# EAGLE design Dashboard r4 (EAGLE 8.3.2)
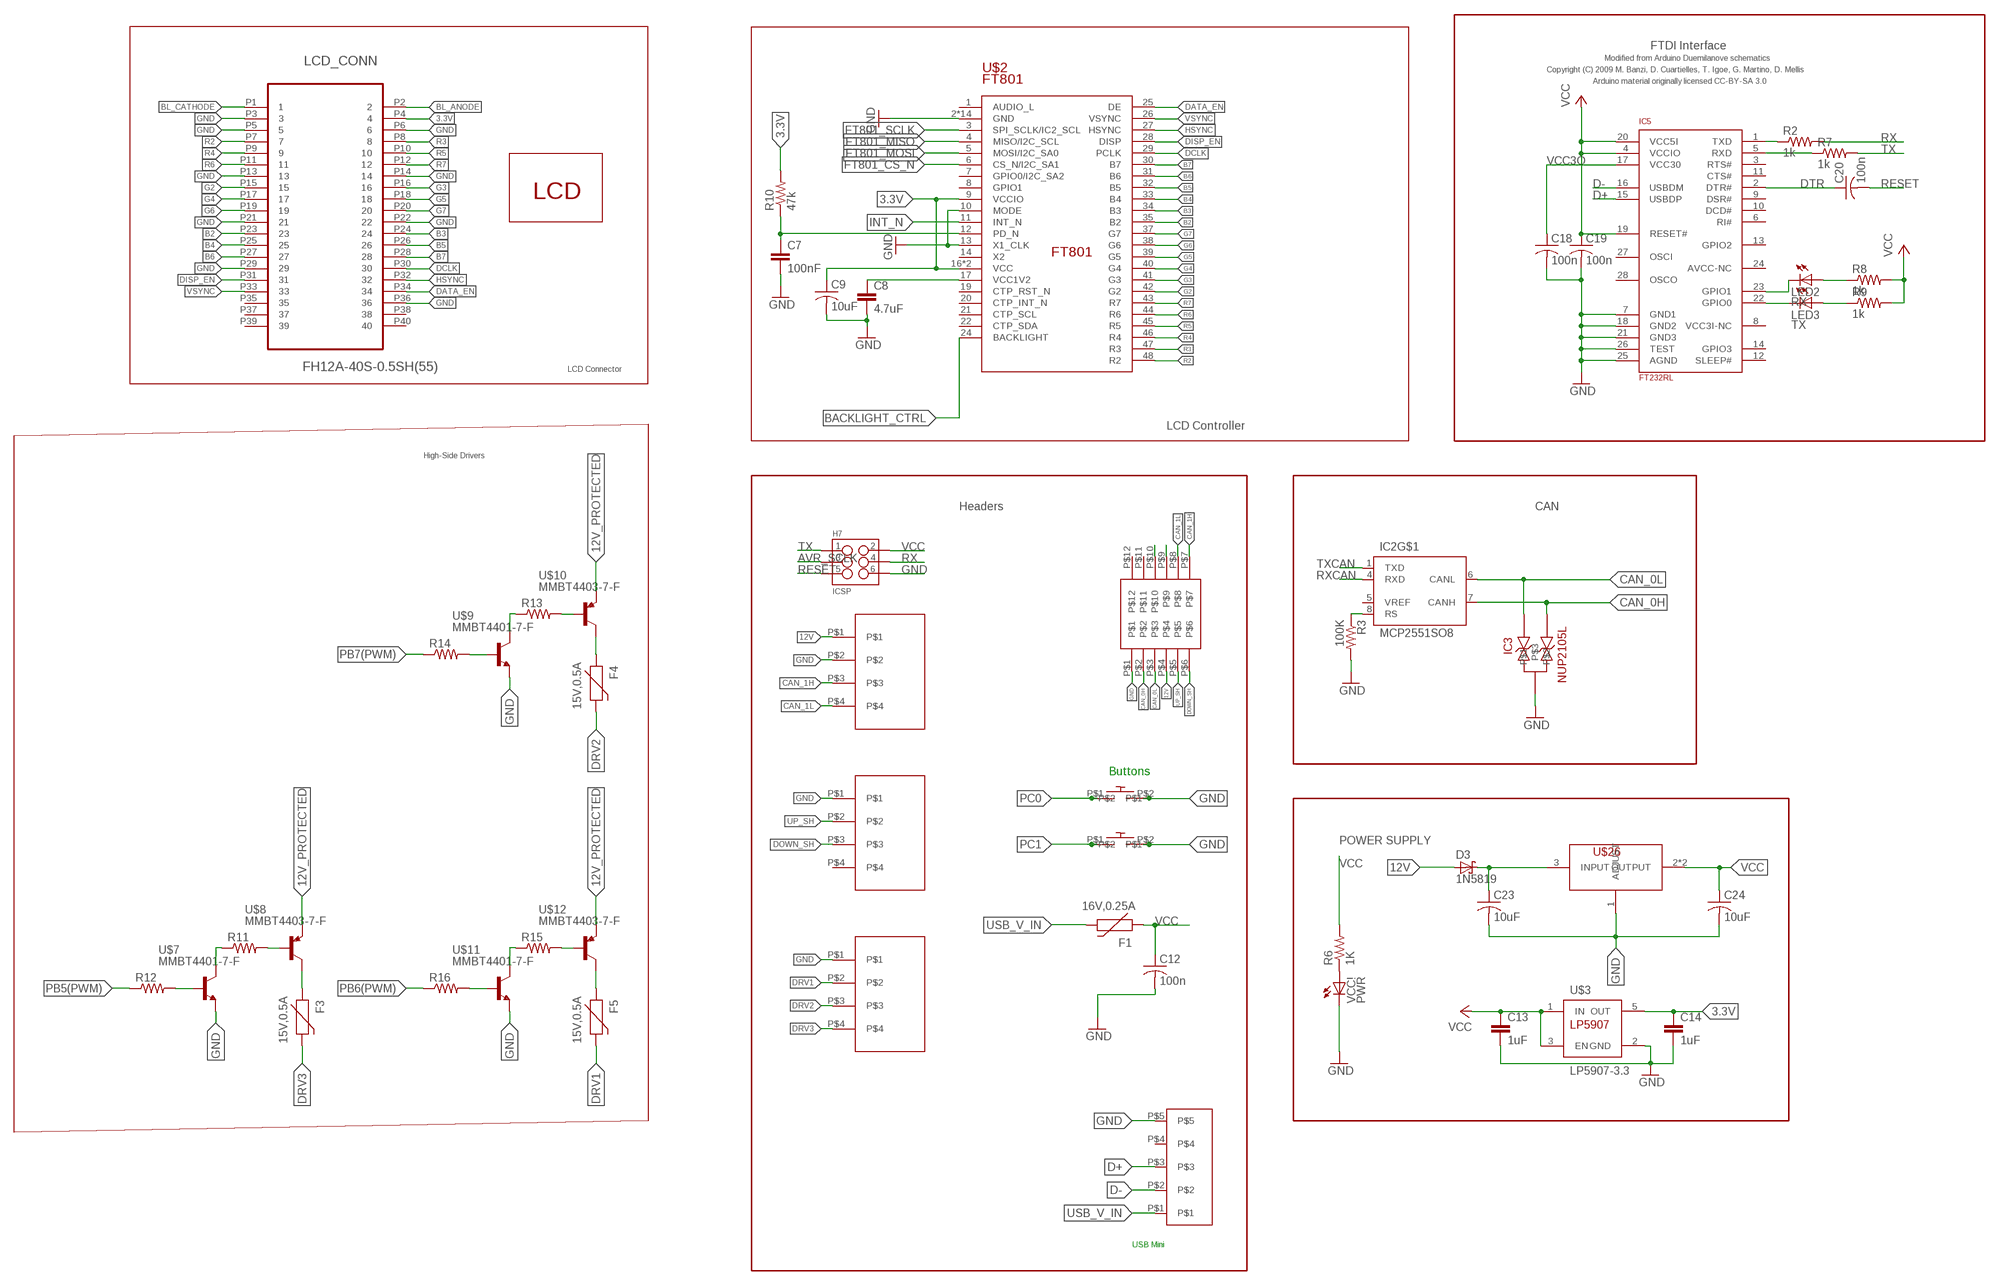
[diagram p0: schematic, sheet 1, part 1 of 2]
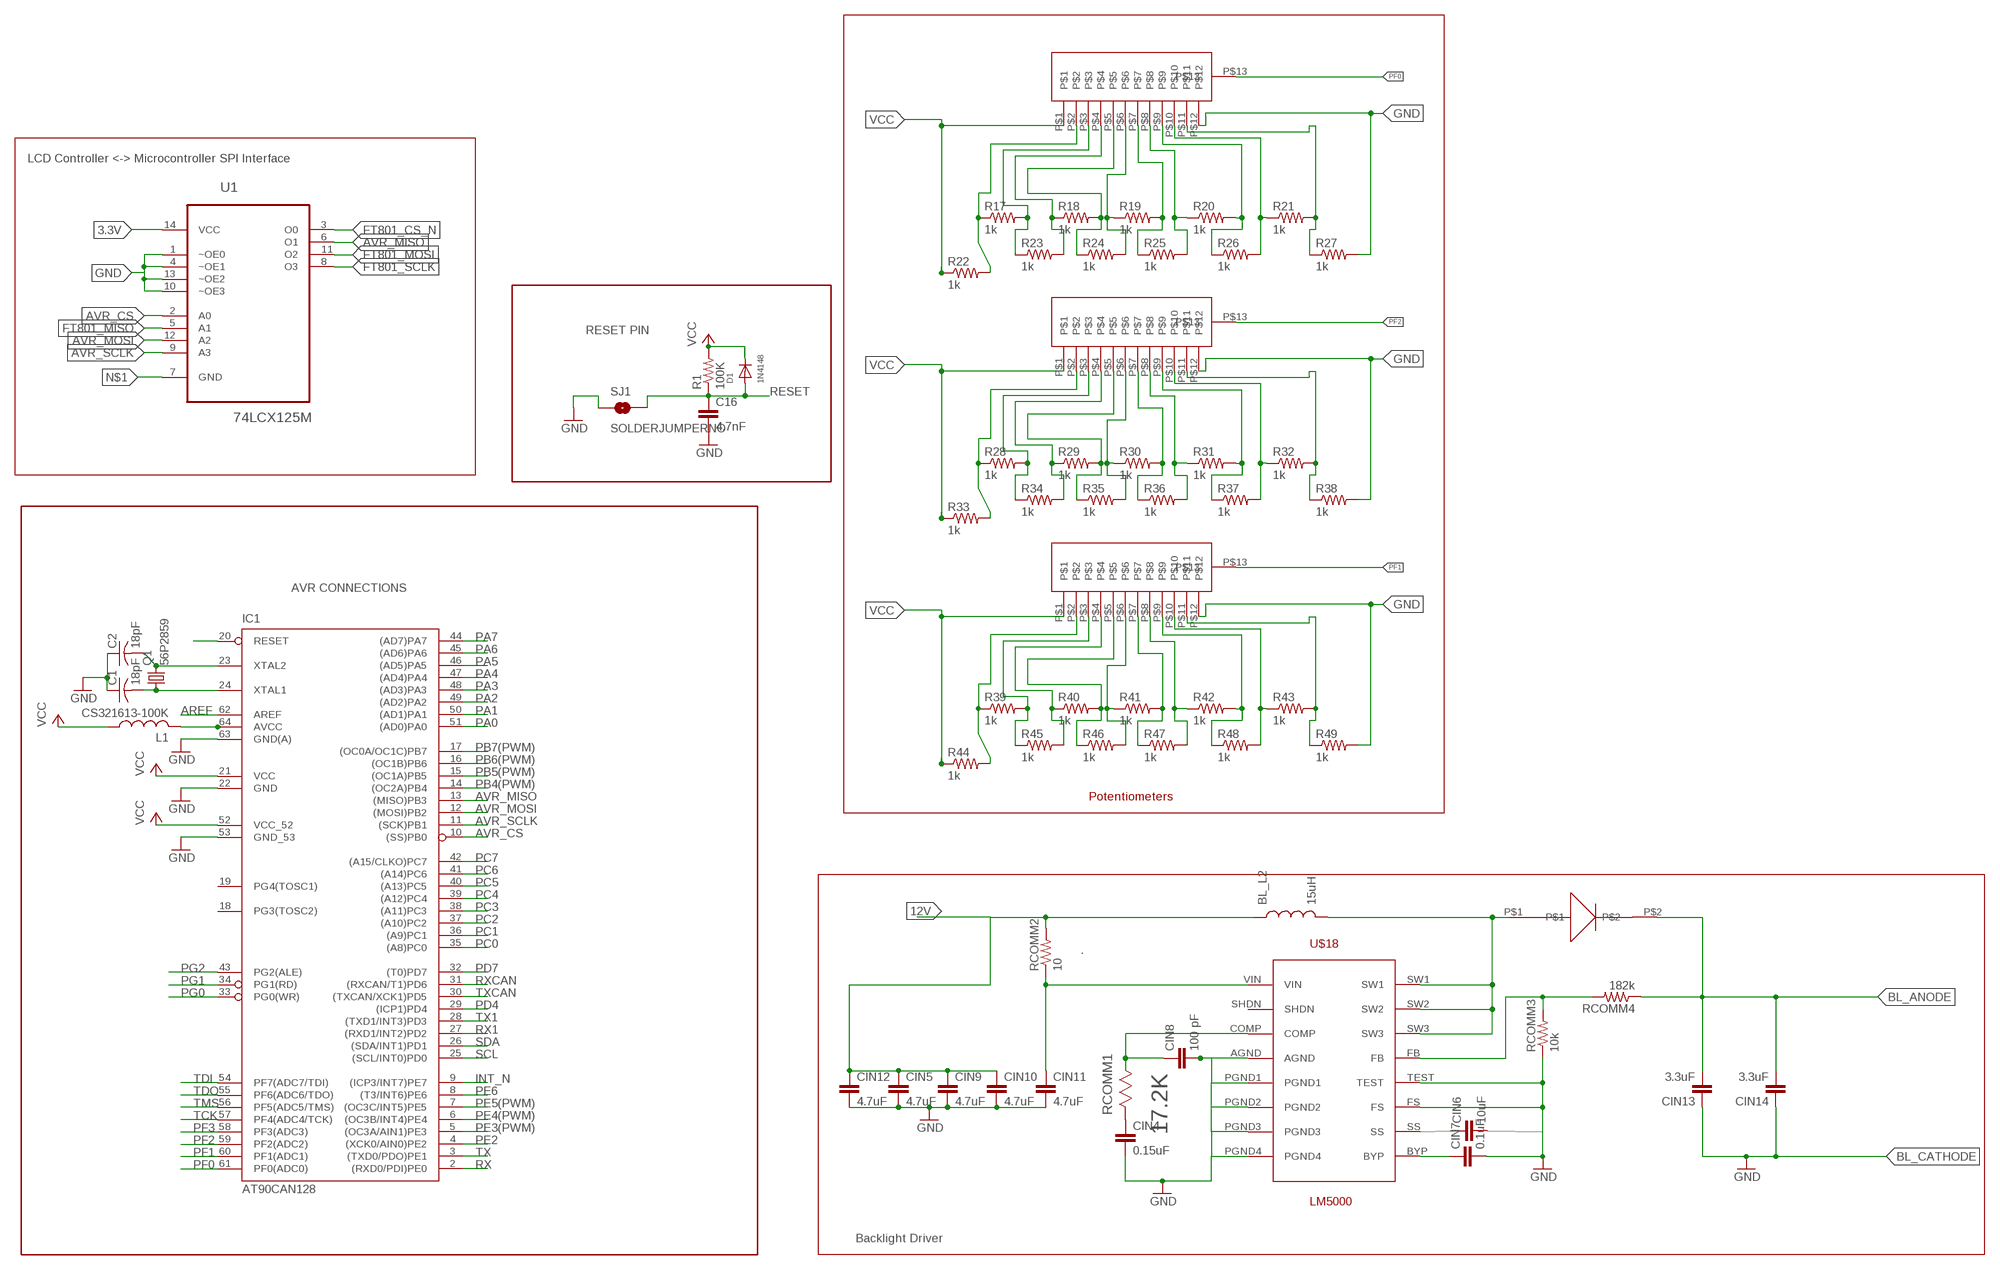
[diagram p1: schematic, sheet 1, part 2 of 2]

## Parts
BL_L2  15uH  LTF4022-D  [2-SMD]
C1  18pF  C-USC0805  [C0805]
C2  18pF  C-USC0805  [C0805]
C7  100nF  CAP0603-CAP  [0603-CAP]
C8  4.7uF  CAP0805  [0805]
C9  10uF  C-US025-024X044  [C025-024X044]
C12  100n  C-USC0805  [C0805]
C13  1uF  CAP0603-CAP  [0603-CAP]
C14  1uF  CAP0603-CAP  [0603-CAP]
C16  4.7nF  CAP0805  [0805]
C18  100n  C-USC0805  [C0805]
C19  100n  C-USC0805  [C0805]
C20  100n  C-USC0805  [C0805]
C23  10uF  C-USC0603  [C0603]
C24  10uF  C-USC0603  [C0603]
CIN4  0.15uF  CAP0805  [0805]
CIN5  4.7uF  CAP0805  [0805]
CIN6  10uF  CAP0805  [0805]
CIN7  0.1uF  CAP0805  [0805]
CIN8  100 pF  CAP0805  [0805]
CIN9  4.7uF  CAP0805  [0805]
CIN10  4.7uF  CAP0805  [0805]
CIN11  4.7uF  CAP0805  [0805]
CIN12  4.7uF  CAP0805  [0805]
CIN13  3.3uF  CAP0805  [0805]
CIN14  3.3uF  CAP0805  [0805]
D1  1N4148  DIODESOD-123  [SOD-123]
D3  1N5819  1N5819-BSOD123  [SOD123]
F1  16V,0.25A  PTCSMD  [PTC-1206]
F3  15V,0.5A  PTCSMD  [PTC-1206]
F4  15V,0.5A  PTCSMD  [PTC-1206]
F5  15V,0.5A  PTCSMD  [PTC-1206]
H7  ICSP  M03X2SMD_FCI  [2X3_SMD_FCI_54202-G30]
IC1  AT90CAN128  [TQFP64]
IC2  MCP2551SO8  [SO08]
IC3  NUP2105L  [SOT-23]
IC5  FT232RL  [SSOP28]
L1  CS321613-100K  L-USL3216C  [L3216C]
LCD_CONN  FH12A-40S-0.5SH(55)  [HIROSE_FH12A-40S-0.5SH(55)]
LED2  RX  LEDCHIPLED_0805  [CHIPLED_0805]
LED3  TX  LEDCHIPLED_0805  [CHIPLED_0805]
Q1  56P2859  CRYSTALSMD  [HC49UP]
R1  100K  R-US_R0805  [R0805]
R2  1k  R-US_R0805  [R0805]
R3  100K  R-US_R0805  [R0805]
R6  1K  R-US_R0805  [R0805]
R7  1k  R-US_R0805  [R0805]
R8  1k  R-US_R0805  [R0805]
R9  1k  R-US_R0805  [R0805]
R10  47k  RESISTOR0603  [0603-RES]
R11  RESISTOR0603  [0603-RES]
R12  RESISTOR0603  [0603-RES]
R13  RESISTOR0603  [0603-RES]
R14  RESISTOR0603  [0603-RES]
R15  RESISTOR0603  [0603-RES]
R16  RESISTOR0603  [0603-RES]
R17  1k  R-US_R0603  [R0603]
R18  1k  R-US_R0603  [R0603]
R19  1k  R-US_R0603  [R0603]
R20  1k  R-US_R0603  [R0603]
R21  1k  R-US_R0603  [R0603]
R22  1k  R-US_R0603  [R0603]
R23  1k  R-US_R0603  [R0603]
R24  1k  R-US_R0603  [R0603]
R25  1k  R-US_R0603  [R0603]
R26  1k  R-US_R0603  [R0603]
R27  1k  R-US_R0603  [R0603]
R28  1k  R-US_R0603  [R0603]
R29  1k  R-US_R0603  [R0603]
R30  1k  R-US_R0603  [R0603]
R31  1k  R-US_R0603  [R0603]
R32  1k  R-US_R0603  [R0603]
R33  1k  R-US_R0603  [R0603]
R34  1k  R-US_R0603  [R0603]
R35  1k  R-US_R0603  [R0603]
R36  1k  R-US_R0603  [R0603]
R37  1k  R-US_R0603  [R0603]
R38  1k  R-US_R0603  [R0603]
R39  1k  R-US_R0603  [R0603]
R40  1k  R-US_R0603  [R0603]
R41  1k  R-US_R0603  [R0603]
R42  1k  R-US_R0603  [R0603]
R43  1k  R-US_R0603  [R0603]
R44  1k  R-US_R0603  [R0603]
R45  1k  R-US_R0603  [R0603]
R46  1k  R-US_R0603  [R0603]
R47  1k  R-US_R0603  [R0603]
R48  1k  R-US_R0603  [R0603]
R49  1k  R-US_R0603  [R0603]
RCOMM1  17.2K  TNPW12062K00BEEN  [RESC3216X71N]
RCOMM2  10  RESISTOR0603  [0603-RES]
RCOMM3  10k  RESISTOR0603  [0603-RES]
RCOMM4  182k  RESISTOR0603  [0603-RES]
SJ1  SOLDERJUMPERNO  [SJ_2S-NO]
U1  74LCX125M  [SOIC127P600X175-14N]
U$2  FT801  [RGZ48_5P15X5P15]
U$3  LP5907-3.3  LP5907  [SOT23-DBV]
U$4  B160-FDICT_NB  [B160-FDICT-NB]
U$7  MMBT4401-7-F  [SOT-23-3]
U$8  MMBT4403-7-F  [SOT-23-3]
U$9  MMBT4401-7-F  [SOT-23-3]
U$10  MMBT4403-7-F  [SOT-23-3]
U$11  MMBT4401-7-F  [SOT-23-3]
U$12  MMBT4403-7-F  [SOT-23-3]
U$13  TCG043WQLBAANN-GN00  [TCG043WQLBAANN]
U$14  ROTSWITCH  [ROTSWITCH]
U$15  1734753-1  [1734753-1]
U$16  ROTSWITCH  [ROTSWITCH]
U$17  ROTSWITCH  [ROTSWITCH]
U$18  LM5000  [LM5000]
U$19  LP4OA1PBBTG  [LP4OA1PBBTG]
U$20  LP4OA1PBBTG  [LP4OA1PBBTG]
U$21  EN3C12M26X  [EN3C12M26X]
U$22  043650-0409  [043650-0409]
U$23  043650-0409  [043650-0409]
U$24  043650-0409  [043650-0409]
U$26  NCP1117  [SOT-223-4]
VCC!  PWR  LEDCHIPLED_0805  [CHIPLED_0805]

## Nets
3.3V: C9.1 C14.1 LCD_CONN.P4 R10.2 U1.14(VCC) U$2.9(VCCIO) U$2.16(VCC) U$2.18(VCC) U$3.5(OUT)
5V_REG_IN: C23.1 D3.C U$26.3(INPUT)
12V [Class2]: BL_L2.1 CIN5.1 CIN9.1 CIN10.1 CIN12.1 D3.A RCOMM2.2 U$21.P$4 U$22.P$1
12V_PROTECTED [Class3]: U$8.P$3(E) U$10.P$3(E) U$12.P$3(E)
AREF: IC1.62(AREF)
AVR_CS: IC1.10((SS)PB0) U1.2(A0)
AVR_MISO: IC1.13((MISO)PB3) U1.6(O1)
AVR_MOSI: IC1.12((MOSI)PB2) U1.12(A2)
AVR_SCLK: H7.3 IC1.11((SCK)PB1) U1.9(A3)
B2: LCD_CONN.P23 U$2.35(B2)
B3: LCD_CONN.P24 U$2.34(B3)
B4: LCD_CONN.P25 U$2.33(B4)
B5: LCD_CONN.P26 U$2.32(B5)
B6: LCD_CONN.P27 U$2.31(B6)
B7: LCD_CONN.P28 U$2.30(B7)
BACKLIGHT_CTRL: U$2.24(BACKLIGHT)
BL_ANODE [Class1]: CIN13.2 CIN14.2 LCD_CONN.P2 RCOMM4.1 U$4.P$2
BL_CATHODE: CIN13.1 CIN14.1 LCD_CONN.P1 ; supply symbol labelled GND
CAN_0H [Class1]: IC2.7(CANH) IC3.2 U$21.P$2
CAN_0L [Class1]: IC2.6(CANL) IC3.1 U$21.P$3
CAN_1H: U$21.P$7 U$22.P$3
CAN_1L: U$21.P$8 U$22.P$4
D+: IC5.15(USBDP) U$15.P$3
D-: IC5.16(USBDM) U$15.P$2
DATA_EN: LCD_CONN.P34 U$2.25(DE)
DCLK: LCD_CONN.P30 U$2.29(PCLK)
DISP_EN: LCD_CONN.P31 U$2.28(DISP)
DOWN_SH: U$21.P$6 U$23.P$3
DRV1 [Class3]: F5.2 U$24.P$2
DRV2 [Class3]: F4.2 U$24.P$3
DRV3 [Class3]: F3.2 U$24.P$4
DTR: C20.1 IC5.2(DTR#)
FT801_CS_N: U1.3(O0) U$2.6(CS_N/I2C_SA1)
FT801_MISO: U1.5(A1) U$2.4(MISO/I2C_SCL)
FT801_MOSI: U1.11(O2) U$2.5(MOSI/I2C_SA0)
FT801_SCLK: U1.8(O3) U$2.3(SPI_SCLK/IC2_SCL)
G2: LCD_CONN.P15 U$2.42(G2)
G3: LCD_CONN.P16 U$2.41(G3)
G4: LCD_CONN.P17 U$2.40(G4)
G5: LCD_CONN.P18 U$2.39(G5)
G6: LCD_CONN.P19 U$2.38(G6)
G7: LCD_CONN.P20 U$2.37(G7)
GND [GND]: C1.1 C2.1 C7.2 C8.2 C9.2 C12.2 C13.2 C14.2 C16.2 C18.2 C19.2 C23.2 C24.2 CIN4.2 CIN5.2 CIN6.2 CIN7.2 CIN8.2 CIN9.2 CIN10.2 CIN11.2 CIN12.2 H7.6 IC1.22(GND) IC1.53(GND_53) IC1.63(GND(A)) IC3.3 IC5.7(GND1) IC5.18(GND2) IC5.21(GND3) IC5.25(AGND) IC5.26(TEST) LCD_CONN.P3 LCD_CONN.P5 LCD_CONN.P6 LCD_CONN.P13 LCD_CONN.P14 LCD_CONN.P21 LCD_CONN.P22 LCD_CONN.P29 LCD_CONN.P36 R3.2 R27.2 R38.2 R49.2 RCOMM3.1 SJ1.1 U1.1(~OE0) U1.4(~OE1) U1.10(~OE3) U1.13(~OE2) U$2.2(GND) U$2.10(MODE) U$2.13(X1_CLK) U$2.15(GND) U$2.23(GND) U$2.36(GND) U$2.EP(GND) U$2.V_1(GND) U$2.V_2(GND) U$2.V_3(GND) U$2.V_4(GND) U$2.V_5(GND) U$2.V_6(GND) U$2.V_7(GND) U$2.V_8(GND) U$2.V_9(GND) U$3.2(GND) U$7.P$3(E) U$9.P$3(E) U$11.P$3(E) U$14.P$12 U$15.P$5 U$16.P$12 U$17.P$12 U$18.AGND U$18.FS U$18.PGND1 U$18.PGND2 U$18.PGND3 U$18.PGND4 U$18.TEST U$19.P$2 U$20.P$2 U$21.P$1 U$22.P$2 U$23.P$1 U$24.P$1 U$26.1(ADJUST) VCC!.C
HSYNC: LCD_CONN.P32 U$2.27(HSYNC)
INT_N: IC1.9((ICP3/INT7)PE7) U$2.11(INT_N)
M8RXD: IC5.1(TXD) R2.1
M8TXD: IC5.5(RXD) R7.1
N$1 [Class2]: U1.7(GND)
N$2: C8.1 U$2.17(VCC1V2)
N$3: C7.1 R10.1 U$2.12(PD_N)
N$4: CIN4.1 RCOMM1.2
N$6: IC2.8(RS) R3.1
N$9: R6.1 VCC!.A
N$11: C1.2 IC1.24(XTAL1) Q1.1
N$22: IC1.64(AVCC) L1.2
N$27 [Class3]: R12.2 U$7.P$2(B)
N$28 [Class3]: R11.2 U$8.P$2(B)
N$29 [Class3]: R11.1 U$7.P$1(C)
N$30 [Class3]: F3.1 U$8.P$1(C)
N$31 [Class3]: R14.2 U$9.P$2(B)
N$32: IC5.23(GPIO1) LED2.C
N$33 [Class3]: R13.2 U$10.P$2(B)
N$34: IC5.22(GPIO0) LED3.C
N$35: LED2.A R8.1
N$36: LED3.A R9.1
N$37 [Class3]: R13.1 U$9.P$1(C)
N$38 [Class3]: F4.1 U$10.P$1(C)
N$39 [Class3]: R16.2 U$11.P$2(B)
N$40 [Class3]: R15.2 U$12.P$2(B)
N$41 [Class3]: R15.1 U$11.P$1(C)
N$42 [Class3]: F5.1 U$12.P$1(C)
N$43: R17.1 R22.2 U$14.P$2
N$44: R17.2 R23.1 U$14.P$3
N$45: R18.1 R23.2 U$14.P$4
N$46: R18.2 R24.1 U$14.P$5
N$47: R20.1 R25.2 U$14.P$8
N$48: R20.2 R26.1 U$14.P$9
N$49: R19.1 R24.2 U$14.P$6
N$50: R19.2 R25.1 U$14.P$7
N$51: R21.1 R26.2 U$14.P$10
N$52: R28.1 R33.2 U$16.P$2
N$53: R21.2 R27.1 U$14.P$11
N$54: R28.2 R34.1 U$16.P$3
N$55: R29.1 R34.2 U$16.P$4
N$56: R29.2 R35.1 U$16.P$5
N$57: R31.1 R36.2 U$16.P$8
N$58: R31.2 R37.1 U$16.P$9
N$59: R30.1 R35.2 U$16.P$6
N$60: R30.2 R36.1 U$16.P$7
N$61: R32.1 R37.2 U$16.P$10
N$62: R32.2 R38.1 U$16.P$11
N$63: R39.1 R44.2 U$17.P$2
N$64: R39.2 R45.1 U$17.P$3
N$65: R40.1 R45.2 U$17.P$4
N$66: R40.2 R46.1 U$17.P$5
N$67: R42.1 R47.2 U$17.P$8
N$68: R42.2 R48.1 U$17.P$9
N$69: R41.1 R46.2 U$17.P$6
N$70: R41.2 R47.1 U$17.P$7
N$71: R43.1 R48.2 U$17.P$10
N$72: R43.2 R49.1 U$17.P$11
N$75: CIN8.1 RCOMM1.1 U$18.COMP
N$77: CIN11.1 RCOMM2.1 U$18.VIN
N$79: BL_L2.2 U$4.P$1 U$18.SW1 U$18.SW2 U$18.SW3
N$80: U$21.P$10
N$81: U$21.P$9
N$82: RCOMM3.2 RCOMM4.2 U$18.FB
N$85: CIN6.1 U$18.SS
N$87: CIN7.1 U$18.BYP
PA0: IC1.51((AD0)PA0)
PA1: IC1.50((AD1)PA1)
PA2: IC1.49((AD2)PA2)
PA3: IC1.48((AD3)PA3)
PA4: IC1.47((AD4)PA4)
PA5: IC1.46((AD5)PA5)
PA6: IC1.45((AD6)PA6)
PA7: IC1.44((AD7)PA7)
PB4(PWM): IC1.14((OC2A)PB4)
PB5(PWM): IC1.15((OC1A)PB5) R12.1
PB6(PWM): IC1.16((OC1B)PB6) R16.1
PB7(PWM): IC1.17((OC0A/OC1C)PB7) R14.1
PC0: IC1.35((A8)PC0) U$19.P$1
PC1: IC1.36((A9)PC1) U$20.P$1
PC2: IC1.37((A10)PC2)
PC3: IC1.38((A11)PC3)
PC4: IC1.39((A12)PC4)
PC5: IC1.40((A13)PC5)
PC6: IC1.41((A14)PC6)
PC7: IC1.42((A15/CLKO)PC7)
PD4: IC1.29((ICP1)PD4)
PD7: IC1.32((T0)PD7)
PE2: IC1.4((XCK0/AIN0)PE2)
PE3(PWM): IC1.5((OC3A/AIN1)PE3)
PE4(PWM): IC1.6((OC3B/INT4)PE4)
PE5(PWM): IC1.7((OC3C/INT5)PE5)
PE6: IC1.8((T3/INT6)PE6)
PF0: IC1.61(PF0(ADC0)) U$14.P$13
PF1: IC1.60(PF1(ADC1)) U$17.P$13
PF2: IC1.59(PF2(ADC2)) U$16.P$13
PF3: IC1.58(PF3(ADC3))
PG0: IC1.33(PG0(WR))
PG1: IC1.34(PG1(RD))
PG2: IC1.43(PG2(ALE))
R2: LCD_CONN.P7 U$2.48(R2)
R3: LCD_CONN.P8 U$2.47(R3)
R4: LCD_CONN.P9 U$2.46(R4)
R5: LCD_CONN.P10 U$2.45(R5)
R6: LCD_CONN.P11 U$2.44(R6)
R7: LCD_CONN.P12 U$2.43(R7)
RESET [Class1]: C16.1 C20.2 D1.A H7.5 IC1.20(RESET) R1.1 SJ1.2
RX: H7.4 IC1.2((RXD0/PDI)PE0) R2.2
RX1: IC1.27((RXD1/INT2)PD2)
RXCAN: IC1.31((RXCAN/T1)PD6) IC2.4(RXD)
SCL: IC1.25((SCL/INT0)PD0)
SDA: IC1.26((SDA/INT1)PD1)
TCK: IC1.57(PF4(ADC4/TCK))
TDI: IC1.54(PF7(ADC7/TDI))
TDO: IC1.55(PF6(ADC6/TDO))
TMS: IC1.56(PF5(ADC5/TMS))
TX: H7.1 IC1.3((TXD0/PDO)PE1) R7.2
TX1: IC1.28((TXD1/INT3)PD3)
TXCAN: IC1.30((TXCAN/XCK1)PD5) IC2.1(TXD)
UP_SH [GND]: U$21.P$5 U$23.P$2
USB_V_IN [Class3]: F1.2 U$15.P$1
VCC [Class1]: C12.1 C13.1 C19.1 C24.1 D1.C F1.1 H7.2 IC1.21(VCC) IC1.52(VCC_52) IC5.4(VCCIO) IC5.19(RESET#) IC5.20(VCC5I) L1.1 R1.2 R6.2 R8.2 R9.2 R22.1 R33.1 R44.1 U$3.1(IN) U$3.3(EN) U$14.P$1 U$16.P$1 U$17.P$1 U$26.2(OUTPUT) U$26.4(OUTPUT)
VCC3O: C18.1 IC5.17(VCC30)
VSYNC: LCD_CONN.P33 U$2.26(VSYNC)
XTAL1: C2.2 IC1.23(XTAL2) Q1.2
Unconnected: IC1.18(PG3(TOSC2)) IC1.19(PG4(TOSC1)) IC2.5(VREF) IC5.3(RTS#) IC5.6(RI#) IC5.8(VCC3I-NC) IC5.9(DSR#) IC5.10(DCD#) IC5.11(CTS#) IC5.12(SLEEP#) IC5.13(GPIO2) IC5.14(GPIO3) IC5.24(AVCC-NC) IC5.27(OSCI) IC5.28(OSCO) LCD_CONN.P35 LCD_CONN.P37 LCD_CONN.P38 LCD_CONN.P39 LCD_CONN.P40 U$2.1(AUDIO_L) U$2.7(GPIO0/I2C_SA2) U$2.8(GPIO1) U$2.14(X2) U$2.19(CTP_RST_N) U$2.20(CTP_INT_N) U$2.21(CTP_SCL) U$2.22(CTP_SDA) U$15.P$4 U$18.SHDN U$21.P$11 U$21.P$12 U$23.P$4

## Notes on the sheet
- LCD Controller <-> Microcontroller SPI Interface
- FTDI Interface
- Modified from Arduino Duemilanove schematics
- Copyright (C) 2009 M. Banzi, D. Cuartielles, T. Igoe, G. Martino, D. Mellis
- Arduino material originally licensed CC-BY-SA 3.0
- RESET PIN
- AVR CONNECTIONS
- LCD Connector
- LCD Controller
- High-Side Drivers
- Headers | CAN
- Potentiometers
- Buttons
- POWER SUPPLY
- Backlight Driver
- USB Mini

## Power pins joined to a net without a drawn wire
GND: IC2.2(GND)
VCC: IC2.3(VCC)

## Library data of the parts
BL_L2 = tdk:LTF4022-D: LTF4022
C1 C2 C12 C18-C20 C23 C24 = rcl:C-US: CAPACITOR, American symbol
C7 C8 C13 C14 C16 CIN4-CIN14 = SparkFun-Capacitors:CAP: Capacitor Standard 0603 ceramic capacitor, and 0.1" leaded capacitor.
C9 = resistor:C-US: CAPACITOR, American symbol
D1 = adafruit:DIODE: Diode SMADIODE - SMA Surface Mount Package 20V 1A Schottky Diode Digikey: 641-1014-6-ND DO-1N4148 - Through Hole Small Current Diode SOD-123 20V 1 A (.5mV Vf) Schottky Diode - Digikey: MBRX120TPMSCT-ND SOD-323 10V 570mA (.38mV Vf, 3ns) Schottky Diode - Digikey: ZLLS410CT-ND SOD-523 30V 30mA Schottky Diode (RB751S-40TE61) - Digikey: RB751S-40TE61CT-ND SOT23-R/W - SOT23 Package (R = Solder Paste/Reflow Ovens, W = Hand-Soldering) BAT54Film 40V 300mA - Digikey: 497-7162-1-ND
D3 = diode:1N581*: 1.0A SCHOTTKY BARRIER RECTIFIER Source: http://www.diodes.com/datasheets/ds23001.pdf
F1 F3-F5 = SparkFun:PTC: Resettable Fuse PTC Resettable Fuse. Spark Fun Electronics SKU : COM-08357
H7 = SparkFun-Connectors:M03X2: 2x3 .1" header. Shrouded, with keying- CONN-10681 SMT- CONN-11415 Pogo pins- HW-11044
IC1 = at90can128:AT90CAN128
IC2 = can:MCP2551: CAN Tranceiver Microchip
IC3 = Artificial Science:NUP2105L
IC5 = SmartPrj:FT232RL
L1 = rcl:L-US: INDUCTOR, American symbol
LCD_CONN = hirose:FH12A-40S-0.5SH(55): SOCKET FFC/FPC, ZIF, 0.5MM, 40WAY; MPN: FH12A-40S-0.5SH(55); OC_FARNELL: 1324569; OC_NEWARK: 34M6194; PACKAGE: SOCKET FFC/FPC, ZIF, 0.5MM, 40WAY; SUPPLIER: Hirose
LED2 LED3 VCC! = led:LED: LED OSRAM: - CHIPLED LG R971, LG N971, LY N971, LG Q971, LY Q971, LO R971, LY R971 LH N974, LH R974 LS Q976, LO Q976, LY Q976 LO Q996 - Hyper CHIPLED LW Q18S LB Q993, LB Q99A, LB R99A - SideLED LS A670, LO A670, LY A670, LG A670, LP A670 LB A673, LV A673, LT A673, LW A673 LH A674 LY A675 LS A676, LA A676, LO A676, LY A676, LW A676 LS A679, LY A679, LG A679 - Hyper Micro SIDELED® LS Y876, LA Y876, LO Y876, LY Y876 LT Y87S - SmartLED LW L88C, LW L88S LB L89C, LB L89S, LG L890 LS L89K, LO L89K, LY L89K LS L896, LA L896, LO L896, LY L896 - TOPLED LS T670, LO T670, LY T670, LG T670, LP T670 LSG T670, LSP T670, LSY T670, LOP T670, LYG T670 LG T671, LOG T671, LSG T671 LB T673, LV T673, LT T673, LW T673 LH T674 LS T676, LA T676, LO T676, LY T676, LB T676, LH T676, LSB T676, LW T676 LB T67C, LV T67C, LT T67C, LS T67K, LO T67K, LY T67K, LW E67C LS E67B, LA E67B, LO E67B, LY E67B, LB E67C, LV E67C, LT E67C LW T67C LS T679, LY T679, LG T679 LS T770, LO T770, LY T770, LG T770, LP T770 LB T773, LV T773, LT T773, LW T773 LH T774 LS E675, LA E675, LY E675, LS T675 LS T776, LA T776, LO T776, LY T776, LB T776 LHGB T686 LT T68C, LB T68C - Hyper Mini TOPLED® LB M676 - Mini TOPLED Santana® LG M470 LS M47K, LO M47K, LY M47K Source: http://www.osram.convergy.de LUXEON: - LUMILED® LXK2-PW12-R00, LXK2-PW12-S00, LXK2-PW14-U00, LXK2-PW14-V00 LXK2-PM12-R00, LXK2-PM12-S00, LXK2-PM14-U00 LXK2-PE12-Q00, LXK2-PE12-R00, LXK2-PE12-S00, LXK2-PE14-T00, LXK2-PE14-U00 LXK2-PB12-K00, LXK2-PB12-L00, LXK2-PB12-M00, LXK2-PB14-N00, LXK2-PB14-P00, LXK2-PB14-Q00 LXK2-PR12-L00, LXK2-PR12-M00, LXK2-PR14-Q00, LXK2-PR14-R00 LXK2-PD12-Q00, LXK2-PD12-R00, LXK2-PD12-S00 LXK2-PH12-R00, LXK2-PH12-S00 LXK2-PL12-P00, LXK2-PL12-Q00, LXK2-PL12-R00 Source: www.luxeon.com KINGBRIGHT: KA-3528ASYC Source: www.kingbright.com
Q1 = SparkFun-FreqCtrl:CRYSTAL: Various standard crystals. Proven footprints. Spark Fun Electronics SKU : COM-00534
R1-R3 R6-R9 R17-R49 = rcl:R-US_: RESISTOR, American symbol
R10-R16 RCOMM2-RCOMM4 = SparkFun-Resistors:RESISTOR: Resistor Basic schematic elements and footprints for 0603, 1206, and PTH resistors.
RCOMM1 = Vishay_By_element14_Batch_1:TNPW12062K00BEEN: RESISTOR, 1206; MPN: TNPW12062K00BEEN; OC_FARNELL: 1562099; OC_NEWARK: 71M1280; SUPPLIER: Vishay Dale; TOLERANCE: ±0.1%; VALUE: 2K Ohms; WATTAGE: 0.25 W
SJ1 = SparkFun-Passives:SOLDERJUMPER: Solder Jumper Standard SMD solder jumper. Used to automate production. Two varients : Normally Open and Normally Closed are the same, but have different paste layers. NC will have a large amount of paste and should jumper during reflow.
U1 = Fairchild_By_element14_Batch_1:74LCX125M: Low Voltage Quad Buffer with 5V Tolerant Inputs and Outputs; MPN: 74LCX125M; OC_FARNELL: 1013776; OC_NEWARK: 78K6286; PACKAGE: SOIC-14; SUPPLIER: Fairchild
U$2 = ftdichip:FT801: IC TFT LCD CONTROLLER 48VQFN
U$3 = texas:LP5907
U$4 = diodes-inc-e14:B160-FDICT_NB
U$7 U$9 U$11 = formula electric:MMBT4401-7-F
U$8 U$10 U$12 = formula electric:MMBT4403-7-F
U$13 = kyocera:TCG043WQLBAANN-GN00
U$14 U$16 U$17 = DashAndCAN library:ROTSWITCH
U$15 = con-tyco:1734753-1
U$18 = texas:LM5000
U$19 U$20 = e-switch:LP4OA1PBBTG
U$21 = molex:EN3C12M26X
U$22-U$24 = molex:043650-0409
U$26 = on-semiconductor:NCP1117

## Net classes
1 Class1: width 0.508 mm, clearance 0.178 mm
2 Class2: width 0.635 mm, clearance 0.178 mm
3 Class3: width 0.559 mm
4 GND: width 0.406 mm

## Board
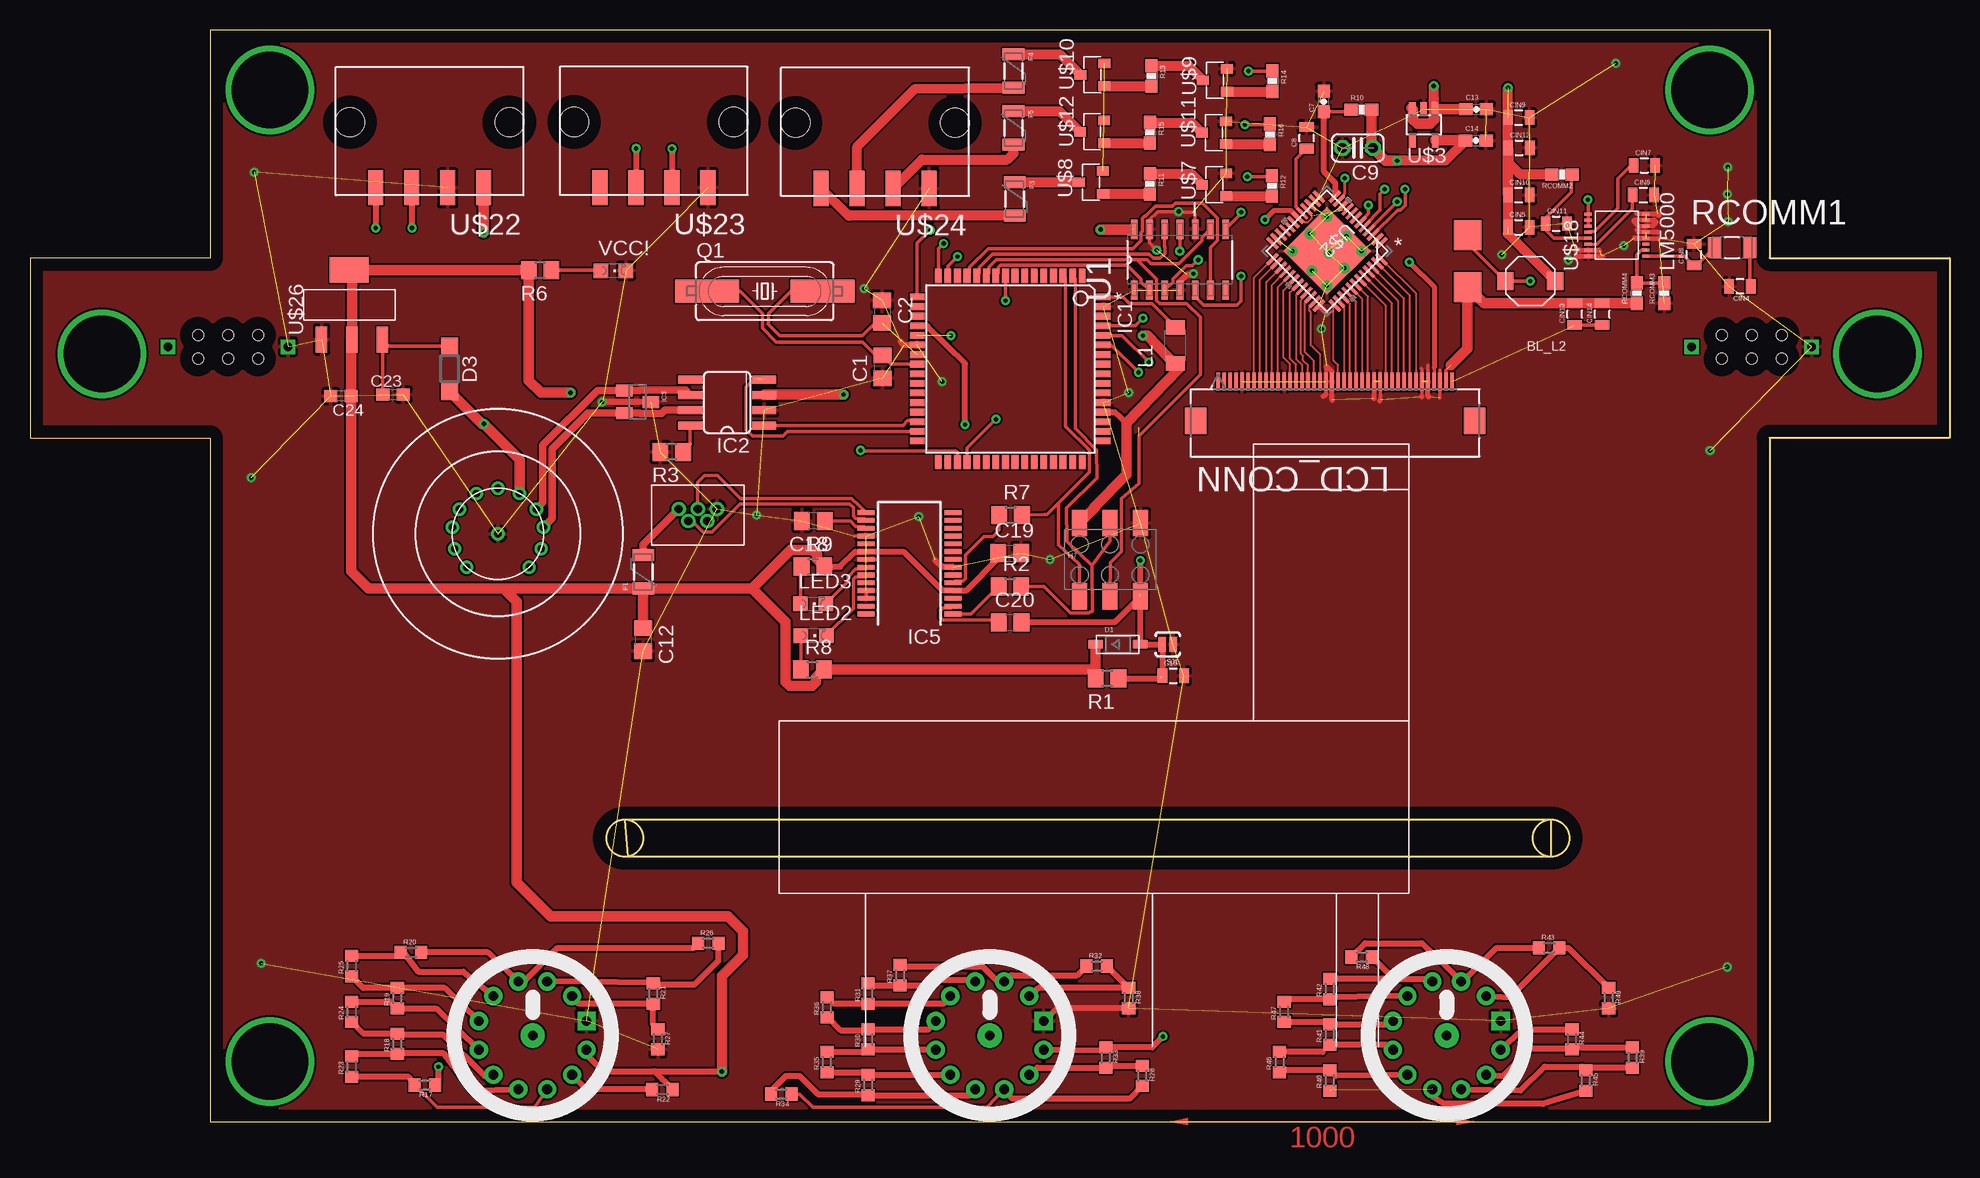
[diagram p2: board, top side]
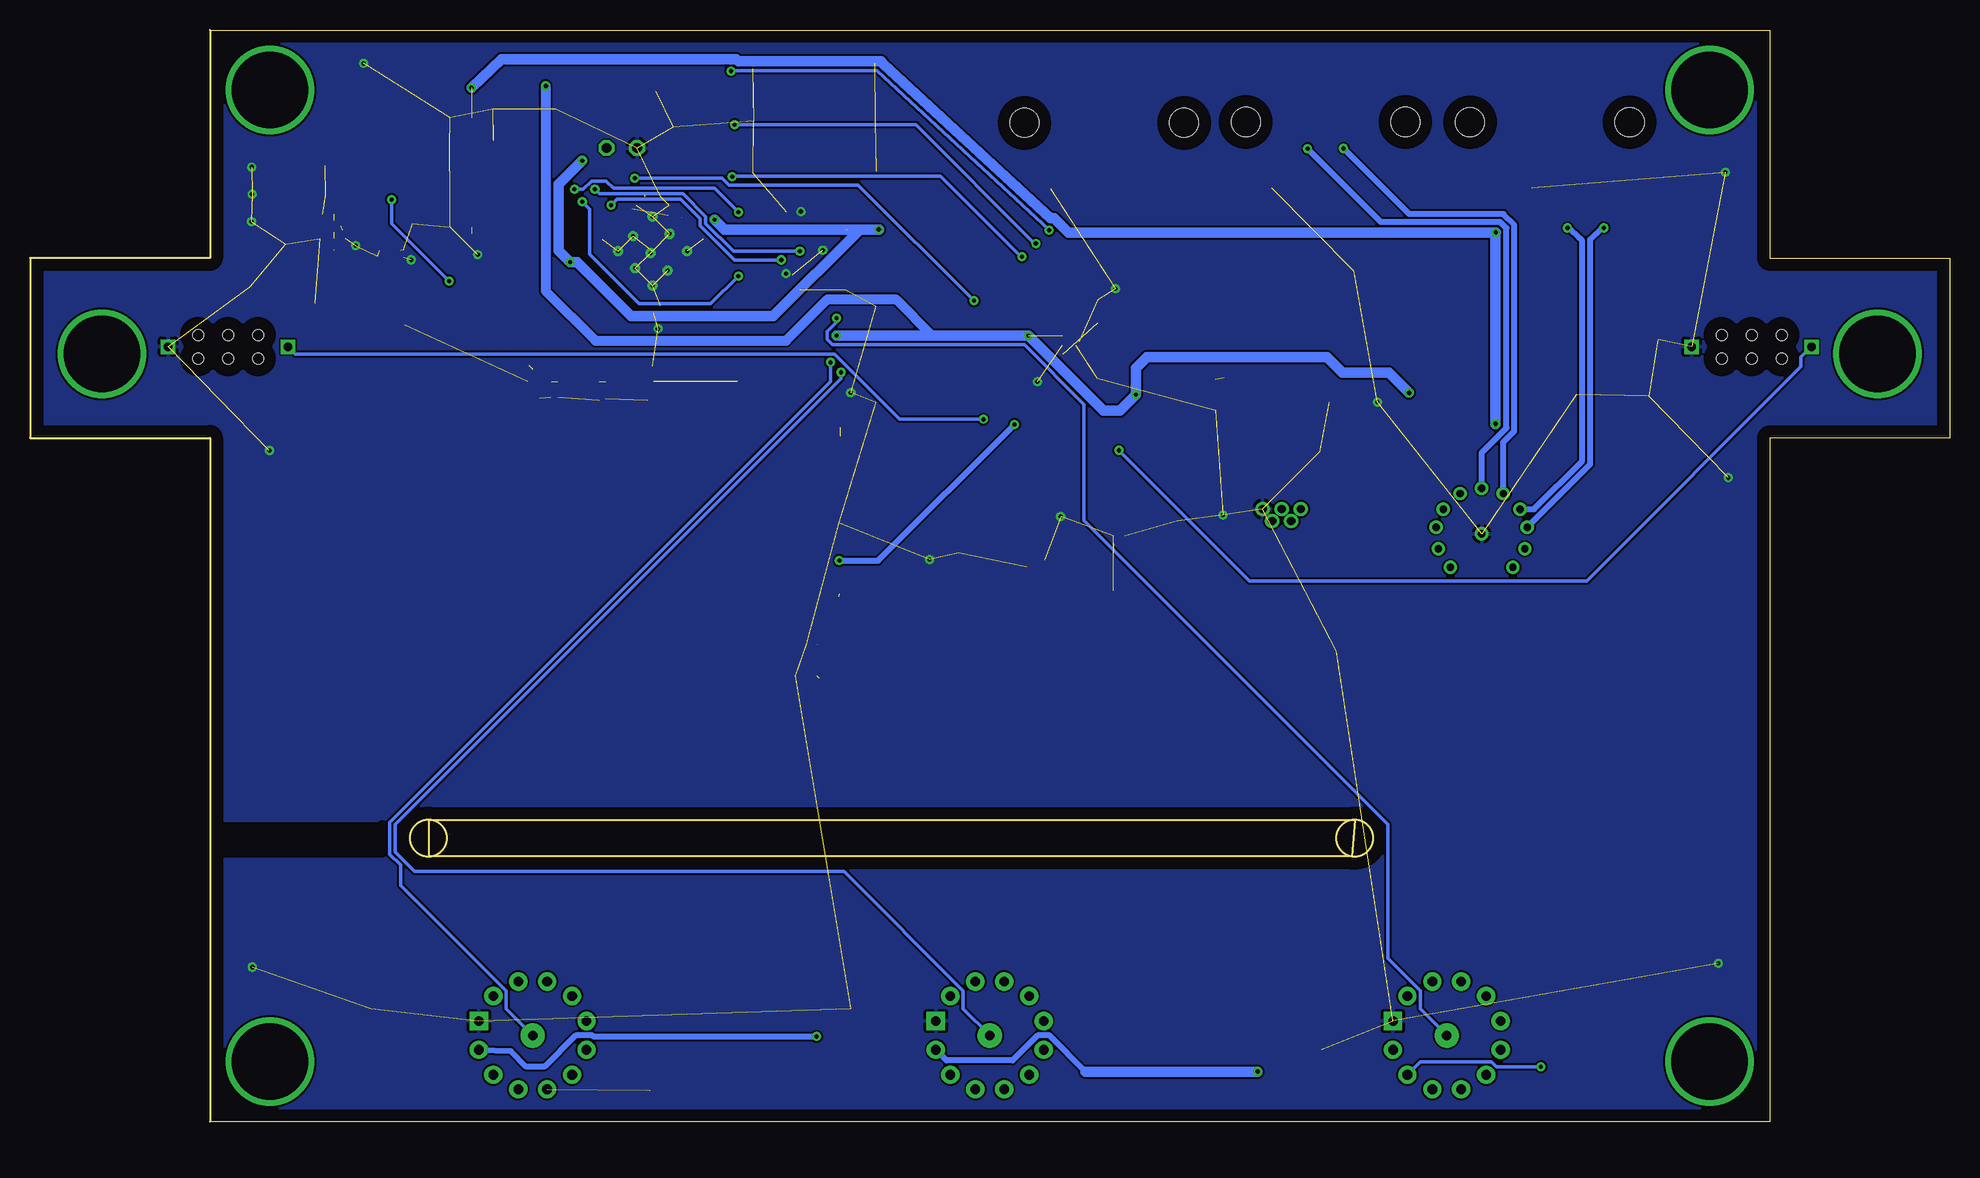
[diagram p3: board, bottom side, seen from below]

Size 160 x 91 mm. Coordinates in mm from the lower left corner, seen from the top.
Outline: 15,0 145,0 145,57 160,57 160,72 145,72 145,91 15,91 15,72 0,72 0,57 15,57 15,0
Outline: 49.8,22.1 126.76,22.1 126.76,25.15 49.54,25.15 49.8,22.1
Outline: circle at 49.57,23.62 radius 1.52
Outline: circle at 126.79,23.62 radius 1.52
Copper layers (1*16): Top 0.035mm / dielectric 1.5mm / Bottom 0.035mm
Design rules "default": minimum track width 6mil, minimum drill 0.35mm, track to track 6mil, track to pad 6mil, pad to pad 6mil, via to via 6mil, smd to smd 6mil, copper to edge 40mil, drill to drill 6mil, minimum pad ring 10mil, minimum via ring 8mil, stop-mask expansion 4mil, vias tented up to drill 0mil, thermal gap 10mil
tKeepout: area 53,37 to 63,47; area 97,37 to 107,47; area 129,22.2 to 150.6,25
bRestrict: area 130.6,22.4 to 146.3,24.7

### Footprints (pad centres in the part's own frame; a part is rotated, then mirrored left to right if it is on the bottom)
2-SMD = smd 1.35 x 1.5: 1 -2.075,0; 2 2.075,0
C0805 = smd 1.3 x 1.5: 1 -0.95,0; 2 0.95,0
0603-CAP = smd 1.1 x 1: 1 -0.85,0; 2 0.85,0
0805 = smd 0.8 x 1.2: 1 -0.9,0; 2 0.9,0
C025-024X044 = drill 0.813 octagon: 1 -1.27,0; 2 1.27,0
C0603 = smd 1.1 x 1: 1 -0.85,0; 2 0.85,0
SOD-123 = smd 1.2 x 0.7: A 1.85,0; C -1.85,0
SOD123 = smd 1.4 x 1.4: A 1.9,0; C -1.9,0
PTC-1206 = smd 1 x 1.8: 1 -1.4,0; 2 1.4,0
2X3_SMD_FCI_54202-G30 = smd 1.27 x 2.18: 1 -2.54,-3.05; 2 -2.54,3.05; 3 0,-3.05; 4 0,3.05; 5 2.54,-3.05; 6 2.54,3.05
TQFP64 = smd 1.194 x 0.559: 1 -7.76,6; 2 -7.76,5.2; 3 -7.76,4.4; 4 -7.76,3.6; 5 -7.76,2.8; 6 -7.76,2; 7 -7.76,1.2; 8 -7.76,0.4; 9 -7.76,-0.4; 10 -7.76,-1.2; 11 -7.76,-2; 12 -7.76,-2.8; 13 -7.76,-3.6; 14 -7.76,-4.4; 15 -7.76,-5.2; 16 -7.76,-6; 33 7.76,-6; 34 7.76,-5.2; 35 7.76,-4.4; 36 7.76,-3.6; 37 7.76,-2.8; 38 7.76,-2; 39 7.76,-1.2; 40 7.76,-0.4; 41 7.76,0.4; 42 7.76,1.2; 43 7.76,2; 44 7.76,2.8; 45 7.76,3.6; 46 7.76,4.4; 47 7.76,5.2; 48 7.76,6 | smd 0.559 x 1.194: 17 -6,-7.76; 18 -5.2,-7.76; 19 -4.4,-7.76; 20 -3.6,-7.76; 21 -2.8,-7.76; 22 -2,-7.76; 23 -1.2,-7.76; 24 -0.4,-7.76; 25 0.4,-7.76; 26 1.2,-7.76; 27 2,-7.76; 28 2.8,-7.76; 29 3.6,-7.76; 30 4.4,-7.76; 31 5.2,-7.76; 32 6,-7.76; 49 6,7.76; 50 5.2,7.76; 51 4.4,7.76; 52 3.6,7.76; 53 2.8,7.76; 54 2,7.76; 55 1.2,7.76; 56 0.4,7.76; 57 -0.4,7.76; 58 -1.2,7.76; 59 -2,7.76; 60 -2.8,7.76; 61 -3.6,7.76; 62 -4.4,7.76; 63 -5.2,7.76; 64 -6,7.76
SO08 = smd 0.66 x 2.032: 1 -1.905,-3.073; 2 -0.635,-3.073; 3 0.635,-3.073; 4 1.905,-3.073; 5 1.905,3.073; 6 0.635,3.073; 7 -0.635,3.073; 8 -1.905,3.073
SOT-23 = smd 1 x 1.4: 1 -0.95,-1.1; 2 0.95,-1.1; 3 0,1.1
SSOP28 = smd 0.381 x 1.499: 1 -4.225,-3.625; 2 -3.575,-3.625; 3 -2.925,-3.625; 4 -2.275,-3.625; 5 -1.625,-3.625; 6 -0.975,-3.625; 7 -0.325,-3.625; 8 0.325,-3.625; 9 0.975,-3.625; 10 1.625,-3.625; 11 2.275,-3.625; 12 2.925,-3.625; 13 3.575,-3.625; 14 4.225,-3.625; 15 4.225,3.625; 16 3.575,3.625; 17 2.925,3.625; 18 2.275,3.625; 19 1.625,3.625; 20 0.975,3.625; 21 0.325,3.625; 22 -0.325,3.625; 23 -0.975,3.625; 24 -1.625,3.625; 25 -2.275,3.625; 26 -2.925,3.625; 27 -3.575,3.625; 28 -4.225,3.625
L3216C = smd 1.2 x 1.6: 1 -1.5,0; 2 1.5,0
HIROSE_FH12A-40S-0.5SH(55) = smd 1.803 x 2.21: 41 -11.633,6.68; 42 11.633,6.68 | smd 0.305 x 1.499: P1 -9.754,3.429; P2 -9.246,3.429; P3 -8.738,3.429; P4 -8.255,3.429; P5 -7.747,3.429; P6 -7.239,3.429; P7 -6.756,3.429; P8 -6.248,3.429; P9 -5.74,3.429; P10 -5.258,3.429; P11 -4.75,3.429; P12 -4.242,3.429; P13 -3.759,3.429; P14 -3.251,3.429; P15 -2.743,3.429; P16 -2.261,3.429; P17 -1.753,3.429; P18 -1.245,3.429; P19 -0.762,3.429; P20 -0.254,3.429; P21 0.254,3.429; P22 0.762,3.429; P23 1.245,3.429; P24 1.753,3.429; P25 2.261,3.429; P26 2.743,3.429; P27 3.251,3.429; P28 3.759,3.429; P29 4.242,3.429; P30 4.75,3.429; P31 5.258,3.429; P32 5.74,3.429; P33 6.248,3.429; P34 6.756,3.429; P35 7.239,3.429; P36 7.747,3.429; P37 8.255,3.429; P38 8.738,3.429; P39 9.246,3.429; P40 9.754,3.429
CHIPLED_0805 = smd 1.2 x 1.2: A 0,-1.05; C 0,1.05
HC49UP = smd 5.334 x 1.93: 1 -4.826,0; 2 4.826,0
R0805 = smd 1.3 x 1.5: 1 -0.95,0; 2 0.95,0
0603-RES = smd 1.1 x 1: 1 -0.85,0; 2 0.85,0
R0603 = smd 1 x 1.1: 1 -0.85,0; 2 0.85,0
RESC3216X71N = smd 1.118 x 1.753: 1 -1.473,0; 2 1.473,0
SJ_2S-NO = smd 0.635 x 1.27: 1 -0.45,0; 2 0.45,0
SOIC127P600X175-14N = smd 1.6 x 0.559: 1 -2.54,3.81; 2 -2.54,2.54; 3 -2.54,1.27; 4 -2.54,0; 5 -2.54,-1.27; 6 -2.54,-2.54; 7 -2.54,-3.81; 8 2.54,-3.81; 9 2.54,-2.54; 10 2.54,-1.27; 11 2.54,0; 12 2.54,1.27; 13 2.54,2.54; 14 2.54,3.81
RGZ48_5P15X5P15 = smd 1.245 x 0.279: 1 -3.683,2.743; 2 -3.683,2.261; 3 -3.683,1.753; 4 -3.683,1.245; 5 -3.683,0.762; 6 -3.683,0.254; 7 -3.683,-0.254; 8 -3.683,-0.762; 9 -3.683,-1.245; 10 -3.683,-1.753; 11 -3.683,-2.261; 12 -3.683,-2.743; 25 3.683,-2.743; 26 3.683,-2.261; 27 3.683,-1.753; 28 3.683,-1.245; 29 3.683,-0.762; 30 3.683,-0.254; 31 3.683,0.254; 32 3.683,0.762; 33 3.683,1.245; 34 3.683,1.753; 35 3.683,2.261; 36 3.683,2.743 | smd 0.279 x 1.245: 13 -2.743,-3.683; 14 -2.261,-3.683; 15 -1.753,-3.683; 16 -1.245,-3.683; 17 -0.762,-3.683; 18 -0.254,-3.683; 19 0.254,-3.683; 20 0.762,-3.683; 21 1.245,-3.683; 22 1.753,-3.683; 23 2.261,-3.683; 24 2.743,-3.683; 37 2.743,3.683; 38 2.261,3.683; 39 1.753,3.683; 40 1.245,3.683; 41 0.762,3.683; 42 0.254,3.683; 43 -0.254,3.683; 44 -0.762,3.683; 45 -1.245,3.683; 46 -1.753,3.683; 47 -2.261,3.683; 48 -2.743,3.683 | smd 5.156 x 5.156: EP 0,0 | drill 0.33: V_1 -2.032,2.032; V_2 0,2.032; V_3 2.032,2.032; V_4 -2.032,0.254; V_5 0,0.254; V_6 2.032,0.254; V_7 -2.032,-2.032; V_8 0,-2.032; V_9 2.032,-2.032
SOT23-DBV = smd 0.55 x 1.2: 1 -0.95,-1.3; 2 0,-1.3; 3 0.95,-1.3; 4 0.95,1.3; 5 -0.95,1.3
B160-FDICT-NB = smd 2.5 x 2.3: P$1 -2.15,0; P$2 2.15,0
SOT-23-3 = smd 0.8 x 0.976: P$1 0,1; P$2 -0.95,-1; P$3 0.95,-1
ROTSWITCH = drill 0.8 pad 1.524: P$1 4.49,-1.203; P$2 3.287,-3.287; P$3 1.203,-4.491; P$4 -1.203,-4.491; P$5 -3.287,-3.287; P$6 -4.491,-1.203; P$7 -4.49,1.203; P$8 -3.287,3.287; P$9 -1.203,4.49; P$10 1.203,4.49; P$11 3.287,3.287 | drill 0.8 pad 1.524 square: P$12 4.49,1.203 | drill 0.8 pad 2.032: P$13 0,0
1734753-1 = drill 0.7 pad 1.1: P$1 -0.5,-1.6; P$2 0.5,-0.8; P$3 -0.5,0; P$4 0.5,0.8; P$5 -0.5,1.6
LM5000 = smd 0.25 x 0.6: AGND 1.75,-0.6; BYP 2.25,4.2; COMP 0.25,-0.6; FB 0.75,-0.6; FS 0.75,4.2; PGND1 2.25,-0.6; PGND2 2.75,-0.6; PGND3 3.25,-0.6; PGND4 3.75,-0.6; SHDN 1.25,-0.6; SS 1.25,4.2; SW1 3.75,4.2; SW2 3.25,4.2; SW3 2.75,4.2; TEST 0.25,4.2; VIN 1.75,4.2
LP4OA1PBBTG = drill 0.7 square: P$1 -5,0; P$2 5,0 | hole 0.9: 0,-0.985; 2.5,-0.985; -2.5,-0.985; -2.5,0.985; 0,0.985; 2.5,0.985
EN3C12M26X = drill 0.6: P$1 0,0; P$2 3.8,0.55; P$3 3.2,2.05; P$4 1.8,3.35; P$5 0,3.8; P$6 -1.8,3.35; P$7 -3.2,2.05; P$8 -3.8,0.55; P$9 -3.6,-1.25; P$10 3.6,-1.25; P$11 -2.6,-2.8; P$12 2.6,-2.8
043650-0409 = smd 1.27 x 2.92: P$1 -4.5,5.47; P$2 -1.5,5.47; P$3 1.5,5.47; P$4 4.5,5.47 | hole 2.41: -6.65,0; 6.65,0
SOT-223-4 = smd 0.95 x 2.15: 1 -2.3,-2.9; 2 0.24,-2.9; 3 2.78,-2.9 | smd 3.25 x 2.15: 4 0,2.9

### Placement (x,y rotation side)
BL_L2  125.06,70.05 180 top
C1  71.06,62.92 90 top
C2  71.04,67.52 270 top
C7  107.84,85.03 90 top
C8  106.41,82 90 top
C9  110.67,81.17 180 top
C12  51.09,40.16 270 top
C13  120.56,84.38 0 top
C14  120.52,81.79 0 top
C16  95.3,37.16 0 top
C18  65.3,50.06 180 top
C19  81.67,47.4 0 top
C20  81.7,41.61 0 top
C23  30.27,60.6 0 top
C24  25.92,60.48 180 top
CIN4  142.53,69.62 180 top
CIN5  124.09,74.55 0 top
CIN6  134.48,77.24 0 top
CIN7  134.56,79.71 0 top
CIN8  138.7,72.26 90 top
CIN9  124.09,83.69 0 top
CIN10  124.09,77.24 0 top
CIN11  127.22,74.85 0 top
CIN12  124.12,81.18 0 top
CIN13  128.77,67.31 90 top
CIN14  131.05,67.31 90 top
D1  90.68,39.78 0 top
D3  34.99,62.76 270 top
F1  51.12,45.82 90 top
F3  82.08,76.9 270 top
F4  81.98,87.57 270 top
F5  81.98,82.82 270 top
H7  90.03,46.84 0 top
IC1  81.71,62.74 270 top
IC2  58.11,59.94 90 top
IC3  50.65,60 270 top
IC5  73.31,46.54 90 top
L1  95.49,64.71 90 top
LCD_CONN  108.79,65.1 180 top
LED2  65.32,40.51 270 top
LED3  65.27,43.16 270 top
Q1  61.25,69.22 0 top
R1  89.78,36.93 180 top
R2  81.69,44.6 0 top
R3  53.49,55.83 180 top
R6  42.52,70.96 180 top
R7  81.74,50.57 0 top
R8  65.21,37.67 0 top
R9  65.27,46.25 0 top
R10  110.98,84.35 0 top
R11  93.36,78.17 270 top
R12  103.51,78 270 top
R13  93.49,87.16 270 top
R14  103.57,86.73 270 top
R15  93.36,82.44 270 top
R16  103.34,82.31 270 top
R17  32.91,3.05 180 top
R18  30.62,6.48 90 top
R19  30.62,10.29 90 top
R20  31.76,14.1 0 top
R21  51.96,10.67 270 top
R22  52.72,2.67 180 top
R23  26.81,4.57 90 top
R24  26.81,9.14 90 top
R25  26.81,12.95 90 top
R26  56.53,14.86 0 top
R27  52.34,6.86 270 top
R28  92.72,3.81 270 top
R29  69.86,3.05 90 top
R30  69.86,6.86 90 top
R31  69.86,10.67 90 top
R32  88.91,12.95 0 top
R33  89.68,5.33 270 top
R34  62.62,2.29 180 top
R35  66.44,4.95 90 top
R36  66.44,9.53 90 top
R37  72.53,12.19 90 top
R38  91.58,10.29 270 top
R39  133.57,5.33 270 top
R40  108.34,3.43 90 top
R41  108.34,7.24 90 top
R42  108.34,11.05 90 top
R43  126.63,14.48 0 top
R44  128.54,6.86 270 top
R45  129.68,3.43 270 top
R46  104.15,4.95 90 top
R47  104.53,9.14 90 top
R48  111.01,13.72 180 top
R49  131.59,10.29 270 top
RCOMM1  141.87,72.85 0 top
RCOMM2  127.7,78.94 180 top
RCOMM3  136.21,69.06 90 top
RCOMM4  133.92,69.06 90 top
SJ1  94.83,39.78 180 top
U1  95.85,71.84 90 top
U$2  108.11,72.56 225 top
U$3  116.18,83.1 180 top
U$4  119.83,71.73 270 top
U$7  98.72,78.09 90 top
U$8  88.43,78.3 90 top
U$9  98.77,86.81 90 top
U$10  88.56,87.26 90 top
U$11  98.69,82.44 90 top
U$12  88.53,82.51 90 top
U$13  91.52,26.24 0 top
U$14  41.9,7.18 0 top
U$15  55.66,50.56 270 top
U$16  80,7.18 0 top
U$17  118.1,7.18 0 top
U$18  134.08,71.91 90 top
U$19  16.5,64.59 0 top
U$20  143.5,64.59 0 top
U$21  39,49 0 top
U$22  33.31,83.31 180 top
U$23  52.01,83.34 180 top
U$24  70.45,83.26 180 top
U$26  26.61,68.1 0 top
VCC!  48.63,70.93 270 top

### Tracks (layer width: path | path; a pad name or v marks a point on that pad's centre or on a via)
3.3V  (via drill 0.35)  (3 unrouted)
  Top 0.152: U$2.18 105.86,75.35 106.27,74.94 106.48,74.94 106.81,75.27 106.81,75.53 106.38,75.96 U$2.16 | LCD_CONN.P4 117.04,62.27 117.03,62.28
  Top 0.305: 117.04,62.86 117.04,62.27
  Top 0.406: U$2.18 105.09,75.95 103.7,75.95 v102.94,75.18 | v114.97,71.65 117.04,69.59 117.04,62.86
  Top 0.813: C14.1 118,80.11 v113.96,80.11
  Top 0.889: U$3.5 C14.1 | v89.24,74.37 91.87,74.37 | v113.96,80.11 113,80.11 C9.1 111.83,81.28 R10.2
  Bottom 0.406: 114.97,71.68 v114.97,71.65
  Bottom 0.889: v102.94,75.18 102.12,74.37 v89.24,74.37 90.81,74.37 98.05,67.13 109.89,67.13 114.42,71.65 v114.97,71.65 115.92,72.6 115.92,78.13 113.96,80.09 v113.96,80.11
5V_REG_IN
  Top 0.305: 29.39,64.57 U$26.3 | 29.39,64.57 29.39,60.63 C23.1 | D3.C 29.48,64.66 29.39,64.57
12V  (via drill 0.35)  (2 unrouted)
  Top 0.813: BL_L2.1 124.51,72.68 123.18,74.01 123.19,79.5 | 123.19,79.5 123.19,80 | 123.19,80 v123.2,86.18 | RCOMM2.2 124.24,78.94 123.19,80 | CIN12.1 123.22,80.02 123.19,80 | CIN10.1 123.19,79.5
  Top 0.889: U$21.P$4 40.8,55.2 v37.84,58.17 37.69,58.17 D3.A | v37.81,74.12 U$22.P$1
  Bottom 0.889: v37.84,58.17 37.84,74.09 v37.81,74.12 73.43,74.12 74.63,75.32 74.93,75.32 88.86,88.16 89.08,88.38 89.09,88.38 89.11,88.39 89.41,88.38 100.95,88.38 101.15,88.58 120.7,88.58 v123.2,86.18
12V_PROTECTED  (2 unrouted)
AVR_CS
  Top 0.305: U1.2 92.62,69.99 92.62,70.23 91.45,71.4 80.91,71.4 80.73,71.22 80.73,70.71 IC1.10
AVR_MISO
  Top 0.305: 98.97,75.31 98.97,73.45 98.39,72.87 U1.6 | 98.79,75.49 98.97,75.31 | IC1.13 78.33,70.71 78.33,71.22 79.88,72.77 91.94,72.77 92.62,73.45 92.62,74.12 92.72,74.22 92.72,75.31 92.9,75.49 92.99,75.49 93.83,76.33 95.24,76.33 95.46,76.55 97.73,76.55 98.79,75.49 | 98.79,75.49 98.97,75.31
AVR_MOSI
  Top 0.305: IC1.12 79.13,70.71 79.13,71.22 80.22,72.31 93.28,72.31 93.64,71.96 94.2,71.96 94.6,72.36 94.6,72.93 94.58,72.95 U1.12 94.58,73.65
AVR_SCLK  (1 unrouted)
  Top 0.305: IC1.11 79.93,70.71 79.93,71.22 80.56,71.86 92.26,71.86 | U1.9 97.7,73.7 97.7,73.45 95.75,71.5 93.45,71.5 93.09,71.86 92.26,71.86 | H7.3 90.05,46.59 90.99,47.53 90.99,51.93 92.43,53.17 92.43,57.15 97.55,62.27 97.55,67.06 96.41,68.2 94.17,68.2 93.91,68.45 93.89,68.45 93.89,70.23 92.26,71.86
B2
  Top 0.152: LCD_CONN.P23 107.54,63.93 106.75,64.72 106.75,67.47 106.65,67.58 106.65,67.91 U$2.35
B3
  Top 0.152: LCD_CONN.P24 107.03,63.38 106.28,64.14 106.28,68.26 U$2.34
B4
  Top 0.152: LCD_CONN.P25 106.53,63.05 106.12,63.45 106.12,63.83 105.95,64 105.95,68.48 106.38,68.92 U$2.33
B5
  Top 0.152: LCD_CONN.P26 106.04,63.06 105.57,63.54 105.57,68.95 U$2.32
B6
  Top 0.152: LCD_CONN.P27 105.54,63.1 105.02,63.62 105.02,69.12 U$2.31
B7
  Top 0.152: LCD_CONN.P28 105.03,63.15 104.47,63.7 104.47,69.28 U$2.30
BL_ANODE  (1 unrouted)
  Top 0.305: LCD_CONN.P2 118.03,62.65 118.12,62.74
  Top 0.889: RCOMM4.1 132.27,68.21 CIN14.2 CIN13.2 128.25,68.21 128.25,68.22 121.18,68.22 U$4.P$2 119.83,64.44 118.43,63.04
BL_CATHODE  (1 unrouted)
  Top 0.305: CIN13.1 CIN14.1
CAN_0H
  Top 0.61: IC2.7 52.94,59.31 52.65,59.01 50.84,59.01 50.81,59.05 IC3.2 46.53,59.05 43.54,56.05 43.54,50.29 U$21.P$2
CAN_0L
  Top 0.61: IC2.6 54.64,60.98 50.84,60.98 50.81,60.95 IC3.1 47.32,60.95 42.75,56.38 42.75,51.6 U$21.P$3
CAN_1H  (via drill 0.35)
  Top 0.305: 31.81,74.53 v31.84,74.5
  Top 0.508: U$22.P$3 31.81,74.53
  Bottom 0.305: 31.74,74.5 v31.84,74.5
  Bottom 0.508: v31.84,74.5 31.69,74.5 30.88,73.69 | 30.88,73.69 30.62,73.43 | U$21.P$7 34.63,51.05 30.62,55.06 30.62,73.43 | 30.62,73.43 30.88,73.69
CAN_1L  (via drill 0.35)
  Top 0.305: v28.81,74.5 v28.82,74.5
  Top 0.508: U$22.P$4 v28.81,74.5
  Bottom 0.305: 28.82,74.4 v28.82,74.5 28.84,74.5
  Bottom 0.508: v28.82,74.5 28.99,74.5 29.96,73.53 29.96,54.79 U$21.P$8
D+
  Top 0.305: 69.08,51.36 | 69.08,51.36 IC5.15 | 69.08,51.36 68.49,51.96 59.21,51.96 57.32,53.85 56.22,53.85 55.66,53.29 U$15.P$3
D-
  Top 0.305: IC5.16 69.53,50.27 68.83,50.27 68.63,50.47 68.63,51.17 68.3,51.5 59.19,51.5 56.84,49.15 56.09,49.15 55.18,50.06 U$15.P$2
DATA_EN
  Top 0.152: LCD_CONN.P34 102.03,70.37 U$2.25
DCLK
  Top 0.152: LCD_CONN.P30 104.04,69.57 U$2.29
DISP_EN
  Top 0.152: LCD_CONN.P31 103.53,69.75 U$2.28
DOWN_SH  (via drill 0.35)
  Top 0.508: v50.51,81.13 U$23.P$3
  Bottom 0.508: U$21.P$6 37.2,56.63 36.27,57.55 36.27,74.75 37.17,75.65 45.03,75.65 v50.51,81.13
DRV1
  Top 0.813: U$24.P$2 74.34,80.19 81.47,80.19 81.98,80.7 F5.2
DRV2
  Top 0.813: F4.2 73.78,86.09 68.95,81.26 U$24.P$3
DRV3
  Top 0.813: F3.2 68.24,75.5 U$24.P$4
DTR
  Top 0.305: C20.1 80.53,41.82 76.08,41.82 75.88,42.02 75.88,42.61 76.08,42.81 76.78,42.81 IC5.2
FT801_CS_N  (via drill 0.35)
  Top 0.305: U$2.6 110.89,75.01 111.56,75.68 v111.56,76.39 | U1.3 95.26,69.99 95.26,70.23 96.41,71.37 96.91,71.37 v97.37,71.83
  Bottom 0.305: v97.37,71.83 101.29,71.83 104.14,74.68 104.14,75.26 105.76,76.88 111.07,76.88 v111.56,76.39
FT801_MISO  (via drill 0.35)
  Top 0.305: U$2.4 111.59,74.32 v113.96,76.68 | U1.5 97.12,68.76 97.8,68.07 100.62,68.07 100.95,68.4 v100.95,70.48
  Bottom 0.305: v100.95,70.48 103.27,68.17 109.21,68.17 113.35,72.31 113.35,76.07 v113.96,76.68
FT801_MOSI  (via drill 0.35)
  Top 0.305: U1.11 95.85,72.57 v95.84,72.56 | U$2.5 111.25,74.7 112.51,75.96 112.51,77.31 v112.92,77.72
  Bottom 0.305: v95.84,72.56 101.36,72.56 103.68,74.87 103.68,75.45 105.57,77.34 112.53,77.34 v112.92,77.72
FT801_SCLK  (via drill 0.35)
  Top 0.305: v114.62,77.72 114.64,77.42 114.64,76.4 114.24,76 114.02,76 U$2.3 | v100.95,75.82 100.95,75.68 U1.8
  Bottom 0.305: v114.62,77.72 113.88,77.72 113.2,78.41 111.96,78.41 111.35,77.8 102.93,77.8 v100.95,75.82
G2
  Top 0.152: LCD_CONN.P15 111.53,68.78 U$2.42
G3
  Top 0.152: LCD_CONN.P16 111.05,68.55 U$2.41
G4
  Top 0.152: LCD_CONN.P17 110.54,68.37 U$2.40
G5
  Top 0.152: LCD_CONN.P18 110.03,68.16 U$2.39
G6
  Top 0.152: LCD_CONN.P19 109.55,67.93 U$2.38
G7
  Top 0.152: LCD_CONN.P20 109.04,63.07 108.66,63.45 108.66,67.91 U$2.37
GND  (via drill 0.35)  (105 unrouted)
  Top 0.305: IC5.26 IC5.25 | v93.92,72.64 93.31,73.25 U1.13 93.28,74.41 93.28,75.13 94.02,75.87 v95.75,75.87 95.8,75.82 96.94,75.82 97.12,75.64 U1.10 | 116.03,60.44 LCD_CONN.P6 116.03,62.73 115.97,62.79 | LCD_CONN.P13 112.55,60.16 | 108.53,60.13 108.5,60.1 | 108.03,60.66 LCD_CONN.P22 108.03,62.9 | LCD_CONN.P5 116.53,63.06 116.52,63.07 | LCD_CONN.P3 117.53,62.63 117.51,60.33 | IC5.18 68.72,48.82 | IC5.21 70.65,46.87 70.65,46.86
  Top 0.406: 108.03,67.44 107.45,68.01 | LCD_CONN.P5 116.53,60.47 116.6,60.4 | 116.03,60.44 115.99,60.4 | 112.55,60.16 112.48,60.1 | LCD_CONN.P14 112.04,60.31 112,60.27 | 108.53,60.13 LCD_CONN.P21 108.53,62.52 108.09,62.97 108.03,62.9 | 108.03,60.66 107.81,60.45 | 135.78,75.54 135.66,75.66 U$18.PGND4 134.01,75.66 133.92,75.74 | 135.65,74.12 135.61,74.16 U$18.PGND1 134.14,74.16 133.97,74.32 | U$18.AGND 133.75,73.66 135.8,73.61 | 129.11,72.66 U$18.FS 130.78,72.66 130.85,72.59 | 128.87,72.67 128.84,72.64 | 128.84,72.03 128.97,72.16 U$18.TEST 131.03,72.16 131.08,72.11 | U$18.PGND3 135.37,75.16 135.55,74.98 135.22,74.66 U$18.PGND2 134.12,74.66 133.69,75.08 133.77,75.16 U$18.PGND3
  Top 0.508: U$2.V_8 U$2.V_9 | U$16.P$12 85.64,9.44 R38.2 | IC5.7 76.05,46.22 75.45,46.81 | IC3.3 47.72,60 v47.69,59.97 | U1.4 95.85,70.02 96.45,70.62 96.92,70.62 v96.99,70.69 | 72.58,65.02 72.87,64.74 IC1.22
  other vias: 132.86,73.03 60.57,50.57 85.03,46.86 74.08,50.44 91.58,60.78 107.66,66.09 122.67,72.26 69.51,69.44 76.04,61.7 128.23,71.83 18.68,79.15 132.2,88.21 141.52,79.58 140.04,55.93 141.47,12.88 19.27,13.18 18.43,53.67 141.49,77.32 141.54,75.03
  pour Top: -9,96.6 162.57,96.6 164.81,94.36 164.81,-5.82 163.46,-7.16 -12.58,-7.16 -14.51,-5.23 -14.51,91.11 -14.49,91.11
  pour Bottom: -9.1,96.62 162.57,96.62 164.86,94.34 164.86,-5.59 163.46,-6.99 -12.91,-6.99 -14.57,-5.33 -14.57,91.16
HSYNC
  Top 0.152: LCD_CONN.P32 103.05,69.98 U$2.27
INT_N  (via drill 0.35)
  Top 0.254: U$2.11 109.11,76.86 109.59,77.33 109.59,77.57 v109.59,78.64
  Top 0.305: v81.32,68.43 IC1.9
  Bottom 0.305: v109.59,78.64 102.3,78.64 101.75,78.08 90.97,78.08 v81.32,68.43
M8RXD
  Top 0.305: IC5.1 78.45,42.32 R2.1
M8TXD
  Top 0.305: IC5.5 77.09,45.07 77.78,45.07 77.98,45.27 77.98,47.24 79.52,48.77 80.26,48.77 80.79,49.3 R7.1
N$2
  Top 0.305: U$2.17 106.04,75.76 105.54,76.26 105.54,80.23 C8.1
N$3  (1 unrouted)
  Top 0.305: C7.1 109.96,84.19 R10.1
  Top 0.508: C7.1 107.86,84.16 107.86,79.17 108.77,78.26 108.77,77.27
N$4
  Top 0.305: RCOMM1.2 143.35,69.71 CIN4.1
N$6
  Top 0.152: 55.04,56.43 R3.1
  Top 0.305: IC2.8 55.04,56.43
N$9
  Top 0.305: R6.1 47.55,70.96 VCC!.A
N$11
  Top 0.305: IC1.24 71.79,63.14 C1.2 70.51,63.87 69.38,65 62.19,65 61.05,66.14 61.05,67.36 59.19,69.22 Q1.1
N$16  (via drill 6.35 pad 6.35)
  other vias: 140,86
N$17  (via drill 6.35 pad 6.35)
  other vias: 20,86
N$18  (via drill 6.35 pad 6.35)
  other vias: 140,5
N$19  (via drill 6.35 pad 6.35)
  other vias: 6,64
N$20  (via drill 6.35 pad 6.35)
  other vias: 154,64
N$21  (via drill 6.35 pad 6.35)
  other vias: 20,5
N$22
  Top 0.305: L1.2 93.5,68.2 91.63,68.2 91.09,68.74 IC1.64
N$27
  Top 0.813: U$7.P$2 103.5,77.14 R12.2
N$28
  Top 0.813: U$8.P$2 93.33,77.35 R11.2
N$29
  Top 0.813: R11.1 96.79,79.02 U$7.P$1
N$30
  Top 0.813: F3.1 U$8.P$1
N$31
  Top 0.813: U$9.P$2 103.55,85.86 R14.2
N$32
  Top 0.305: LED2.C 68.63,42.78 68.63,45.21 68.83,45.41 69.53,45.41 IC5.23
N$33
  Top 0.813: U$10.P$2 R13.2
N$34
  Top 0.305: IC5.22 69.53,46.06 68.83,46.06 68.17,45.4 68.17,45 LED3.C
N$35
  Top 0.305: LED2.A R8.1
N$36
  Top 0.305: LED3.A 64.22,46.16 R9.1
N$37
  Top 0.813: R13.1 96.56,88.01 U$9.P$1
N$38
  Top 0.813: F4.1 85.85,88.97 U$10.P$1
N$39
  Top 0.813: U$11.P$2 103.31,81.49 R16.2
N$40
  Top 0.813: U$12.P$2 93.33,81.56 R15.2
N$41
  Top 0.813: R15.1 96.84,83.29 U$11.P$1
N$42
  Top 0.813: F5.1 85.83,84.22 U$12.P$1
N$43  (via drill 0.35)
  Top 0.305: R17.1 34.05,3.34
  Top 0.508: R22.2 46.31,2.67 U$14.P$2 | 34.05,3.34 v34.05,4.57
  Bottom 0.305: v34.05,4.57 37.78,4.57 38.17,4.96 44.12,4.96 U$14.P$2
N$44
  Top 0.305: U$14.P$3 42.06,1.17 33.94,1.17 R17.2
  Top 0.508: R17.2 31.56,3.72 R23.1
N$45
  Top 0.305: R23.2 27.02,5.63 | R18.1 31.3,5.71
  Top 0.508: 27.02,5.63 R18.1 | 31.3,5.71 34.43,5.71 36.8,2.59 U$14.P$4
N$46
  Top 0.305: U$14.P$5 37.88,3.79 | 30.71,7.24 R18.2
  Top 0.508: R18.2 27.78,7.33 R24.1 | 37.88,3.79 34.43,7.24 30.71,7.24
N$47
  Top 0.305: 30.62,13.8 R20.1 31.13,14.1
  Top 0.508: R25.2 30.62,13.8 | 31.13,14.1 32.37,12.48 36.12,12.48 U$14.P$8
N$48
  Top 0.305: U$14.P$9 41.05,11.57 | 55.3,14.48 R26.1
  Top 0.508: U$14.P$9 38.17,14.1 R20.2 | 41.05,11.57 43.96,14.48 55.3,14.48
N$49
  Top 0.508: R24.2 30.06,9.99 R19.1 33.85,9.44 U$14.P$6
N$50
  Top 0.508: U$14.P$7 34.56,11.14 R19.2 27.78,11.14 R25.1
N$51
  Top 0.305: 51.91,11.57 R21.1 52.05,11.43
  Top 0.508: 51.91,11.57 U$14.P$10 | 52.05,11.43 55.39,11.43 57.38,13.42 R26.2
N$52
  Top 0.305: U$16.P$2 83.98,4.48 | R33.2 89.85,4.66
  Top 0.508: 83.98,4.48 R33.2 | 89.85,4.66 R28.1
N$53
  Top 0.305: R27.1 51.96,8.09
  Top 0.508: U$14.P$11 45.74,9.82 R21.2 51.96,8.09
N$54
  Top 0.305: R34.1 64.15,2.29 65.27,1.17 79.78,1.17 U$16.P$3
  Top 0.508: R28.2 91.67,1.91 81.89,1.91 U$16.P$3
N$55
  Top 0.305: 78.41,2.2 U$16.P$4 | R34.2 61.77,2.58 | 69.78,2.29 R29.1
  Top 0.508: R29.1 78.41,2.2 | 61.77,2.58 63.01,3.81 64.15,3.81 65.67,2.29 69.78,2.29
N$56
  Top 0.305: 69.66,4.1 R29.2 | 76.61,3.9 U$16.P$5
  Top 0.508: R35.1 69.66,4.1 | R29.2 76.61,3.9
N$57
  Top 0.305: 76.16,9.82 U$16.P$8 | 66.99,9.82 R36.2
  Top 0.508: 76.16,9.82 R31.1 66.99,9.82
N$58
  Top 0.305: 78.59,11.78 U$16.P$9
  Top 0.508: R31.2 70.04,11.34 R37.1 75.11,11.34 75.58,11.81 78.56,11.81 78.59,11.78
N$59
  Top 0.305: 75.38,6.01 U$16.P$6 | 69.66,5.8 R30.1
  Top 0.508: R30.1 75.38,6.01 | R35.2 69.66,5.8
N$60
  Top 0.305: R36.1 66.52,8.68 | 69.78,7.62 R30.2 | 74.94,7.71 U$16.P$7
  Top 0.508: 66.52,8.68 67.58,7.62 69.78,7.62 | R30.2 74.94,7.71
N$61
  Top 0.305: U$16.P$10 81.83,12.19
  Top 0.508: R32.1 87.3,12.19 81.83,12.19 | R37.2 72.62,12.95 79.39,12.95 80.77,11.57 U$16.P$10
N$62
  Top 0.508: U$16.P$11 84.06,11.14 R38.1 R32.2
N$63
  Top 0.152: 128.71,6.18 R44.2 128.45,6.1
  Top 0.508: 128.71,6.18 R39.1 | U$17.P$2 122.81,3.79 125.11,6.1 128.45,6.1
N$64
  Top 0.152: 129.89,4.48 R45.1 129.39,4.57
  Top 0.508: R39.2 129.89,4.48 | U$17.P$3 124.27,2.59 126.25,4.57 129.39,4.57
N$65  (2 unrouted)
  Top 0.152: 116.9,2.06 U$17.P$4
  Top 0.508: R45.2 126.11,1.47 117.87,1.47 116.9,2.06
N$66
  Top 0.305: 108.83,3.79 R40.2 | 104.33,4.28 R46.1
  Top 0.508: U$17.P$5 108.83,3.79 | R40.2 104.33,4.28
N$67
  Top 0.305: 108.51,10.37 R42.1 | 104.74,10.2 R47.2
  Top 0.508: U$17.P$8 108.51,10.37 | R42.1 104.74,10.2
N$68
  Top 0.152: U$17.P$9 116.57,11.9
  Top 0.508: 113.68,11.9 R42.2 | 113.68,11.9 116.57,11.9 | R48.1 113.68,11.9
N$69
  Top 0.305: U$17.P$6 113.1,6.39 | R41.1 107.76,5.8
  Top 0.508: 113.1,6.39 R41.1 | 107.76,5.8 R46.2
N$70
  Top 0.305: 108.14,8.29 R41.2 | 113.42,8.09 U$17.P$7
  Top 0.508: R47.1 108.14,8.29 | R41.2 113.42,8.09
N$71
  Top 0.305: U$17.P$10 119.47,11.74
  Top 0.508: 119.47,11.74 122.21,14.48 R43.1 | R48.2 111.31,14.86 116.01,14.86 U$17.P$10
N$72
  Top 0.508: R49.1 128.25,14.48 R43.2 123.37,10.37 U$17.P$11
N$75
  Top 0.305: U$18.COMP 137.9,72.16 CIN8.1 138.92,71.36 RCOMM1.1
N$77
  Top 0.305: U$18.VIN 128.78,73.66 127.01,73.66 126.32,74.36 CIN11.1 126.32,75.3 128.49,77.47 128.49,78.88 RCOMM2.1
N$79  (via drill 0.35)
  Top 0.305: U$18.SW1 U$18.SW2 U$18.SW3 129.88,76.84 v129.86,76.86 | U$4.P$1 119.83,73.21 BL_L2.2 v125.06,70.05
  Bottom 0.305: v129.86,76.86 129.86,74.85 v125.06,70.05
N$82  (1 unrouted)
  Top 0.305: 134.68,72.69 134.35,72.69 133.92,72.26 RCOMM4.2 RCOMM3.2
N$85
  Top 0.254: 131.03,73.53 130.75,73.25 130.65,73.16 U$18.SS
  Top 0.305: 130.75,73.25 133.42,75.92 133.42,75.95 133.58,76.12 CIN6.1
N$87
  Top 0.305: U$18.BYP 129.92,74.2 130.4,74.2 132.35,76.15 132.35,78.61 133.44,79.7 CIN7.1
PB5(PWM)  (via drill 0.35)
  Top 0.152: 103.42,78.77 R12.1
  Top 0.305: IC1.15 76.51,71.32 v77.31,72.11 | v101.46,78.77 103.42,78.77
  Bottom 0.152: v77.31,72.11 77.41,72.11 | 101.41,78.82 v101.46,78.77
  Bottom 0.305: 77.41,72.11 84.11,78.82 101.41,78.82
PB6(PWM)  (via drill 0.35)
  Top 0.152: 103.29,83.11 R16.1
  Top 0.305: IC1.16 75.71,72.75 v76.16,73.2 | v101.26,83.11 103.29,83.11
  Bottom 0.152: v76.16,73.2 76.27,73.2 | 101.39,83.08 v101.26,83.11
  Bottom 0.305: 76.27,73.2 86.14,83.08 v101.26,83.11
PB7(PWM)  (via drill 0.35)
  Top 0.305: IC1.17 73.95,73.23 v75.05,74.32 | v101.56,87.58 R14.1
  Bottom 0.152: v75.05,74.32 75.05,74.37 | 101.44,87.61 v101.56,87.58
  Bottom 0.305: 75.05,74.37 89.4,87.61 101.44,87.61
PC0  (via drill 0.35)
  Top 0.305: IC1.35 77.3,55.17 77.3,55.75 77.09,55.88 69.3,55.88 v69.23,55.96
  Bottom 0.305: U$19.P$1 12.38,63.71 12.38,62.94 30.24,45.08 58.35,45.08 v69.23,55.96
PC1  (via drill 0.35)
  Top 0.305: IC1.36 78.11,56.13 v80.53,58.55 | 138.45,64.64 U$20.P$1
  Bottom 0.305: v80.53,58.55 87.52,58.55 92.95,63.98 137.89,63.98 U$20.P$1
PF0  (via drill 0.35)
  Top 0.305: IC1.61 92.13,66.34 v92.78,66.98
  Bottom 0.305: v92.78,66.98 92.78,66.63 93.55,65.85 93.55,65.21 93.1,64.76 77.09,64.76 72.13,59.79 72.13,50.09 46.8,24.77 46.8,13.59 44.12,10.91 44.12,9.4 U$14.P$13
PF1  (via drill 0.35)
  Top 0.305: IC1.60 91.04,65.54 v93.28,63.3
  Bottom 0.305: U$17.P$13 120.32,9.4 120.32,10.91 129.12,19.7 129.12,21.39 130.01,22.29 130.01,24.96 93.28,61.69 v93.28,63.3
PF2  (via drill 0.35)
  Top 0.305: IC1.59 90.11,64.74 v92.39,62.46
  Bottom 0.305: U$16.P$13 82.22,9.4 82.22,10.91 92.17,20.85 127.93,20.85 129.55,22.48 129.55,24.77 92.39,61.93 v92.39,62.46
R2
  Top 0.152: LCD_CONN.P7 115.54,69.01 U$2.48
R3
  Top 0.152: LCD_CONN.P8 115.03,68.83 U$2.47
R4
  Top 0.152: LCD_CONN.P9 114.53,68.62 U$2.46
R5
  Top 0.152: LCD_CONN.P10 114.05,68.39 U$2.45
R6
  Top 0.152: LCD_CONN.P11 113.54,68.21 U$2.44
R7
  Top 0.152: LCD_CONN.P12 113.03,68 U$2.43
RESET  (via drill 0.35)  (3 unrouted)
  Top 0.508: C20.2 90.39,41.61 H7.5 92.57,46.74 v92.55,46.76 | IC1.20 74.78,66.34 74.79,66.33 77.97,63.17 77.94,63.15 v77.94,58.12 | 94.4,39.6 C16.1 | 94.4,39.6 94.4,39.76 | R1.1 94.17,36.93 | 92.53,43.98 D1.A 94.22,39.78 94.4,39.6
  Bottom 0.508: v92.55,46.76 89.3,46.76 v77.94,58.12
RX
  Top 0.305: 89.64,49.89 H7.4 90.03,48.39 88.53,46.34 | IC1.2 87.13,70.28 87.13,57.77 88.91,56 88.93,53.63 86.39,51.15 86.42,48.34 88.53,46.34 | 88.53,46.34 88.55,42.55 88.25,42.39 86.73,42.39 84.52,44.6 R2.2
RXCAN  (1 unrouted)
  Top 0.305: IC1.31 63.14,57.54 62.75,57.15 60.21,57.15 59.7,57.66 59.7,61.21 60.47,61.98
TX
  Top 0.305: H7.1 87.49,46.45 85.71,48.08 85.71,51.54 | IC1.3 86.33,70.28 86.33,57.93 88.3,55.96 88.32,54.15 85.71,51.54 | R7.2 84.52,50.6 84.76,50.6 85.71,51.54
TXCAN
  Top 0.305: IC2.1 72.78,58.04 73.17,58.42 73.87,58.42 IC1.30
UP_SH  (via drill 0.35)
  Top 0.508: v53.51,81.1 U$23.P$2
  Bottom 0.508: v53.51,81.1 47.4,74.99 37.45,74.99 36.93,74.48 36.93,57.83 39,55.76 U$21.P$5
USB_V_IN
  Top 0.61: F1.2 51.12,48.12 U$15.P$1
VCC  (via drill 0.35)  (2 unrouted)
  Top 0.508: U$17.P$1 124.42,7.71 R44.1 | U$16.P$1 89.37,5.88 R33.1 93.54,6.18 v94.44,7.09 | 52.07,4.17 R22.1 | IC1.52 90.41,59.14 91.4,58.22 | C19.1 80.72,46.97 78.04,44.29 IC5.4 76.9,44.29 76.03,44.29 72.8,47.52 IC5.20 69.65,47.49 68.78,47.49 67.54,46.25 R9.2 | U$14.P$1 46.39,5.57 47.77,4.19 52.05,4.19 52.07,4.17 | v57.67,4.17 52.07,4.17
  Top 0.813: 115.11,84.51 U$3.3 115.28,84.34 | 119.69,84.4 C13.1 | 115.64,83.17 115.68,83.21 116.69,83.21 117.03,83.55 117.03,85.24 117.03,86.31 v117.01,86.33
  Top 0.889: 119.69,84.4 U$3.1 117.07,84.34 117.07,83.54 116.71,83.17 115.64,83.17 115.28,83.54 115.28,84.34 | F1.1 51.12,41.14 C12.1 | R9.2 65.59,46.88 65.59,47.26 65.22,47.63 63.41,47.63 60.2,44.42 | 60.2,44.42 F1.1 | 60.2,44.42 62.99,41.63 62.99,36.66 63.36,36.3 65.17,36.3 65.54,36.66 65.54,37.04 R8.2 88.55,37.67 88.83,37.39 | 95.76,62.76 L1.1 | 95.76,62.76 91.4,58.22 91.38,53.92 88.72,51.21 88.77,51.17 H7.2 | v92.78,65.53 93.14,65.53 95.76,62.76 | v67.81,60.6 61.21,60.6 IC2.3 | v45.05,60.76 42.58,60.76 41.58,61.77 R6.2 41.54,71 U$26.4 26.85,70.76 U$26.2 26.77,65.12 C24.1 26.77,45.91 28.23,44.45 39.49,44.45 | 88.83,36.68 R1.2 88.83,37.39 | 39.49,44.45 51.09,44.45 F1.1 | 39.49,44.45 40.58,43.36 40.58,19.94 43.4,17.12 58.18,17.12 59.42,15.88 59.42,13.89 57.67,12.14 v57.67,4.17 | 88.83,37.39 D1.C
  Bottom 0.508: U$17.P$1 119.94,5.88 118.63,4.57 117.11,4.57 114.51,7.17 113.11,7.17 113.02,7.07 102.15,7.07 102.14,7.09 v94.44,7.09 | U$16.P$1 83.6,5.09 78.09,5.09 76,7.17 75.02,7.17 72.01,4.17
  Bottom 0.813: v117.01,86.33 117.01,69.24 112.87,65.1 96.97,65.1 93.51,68.56 87.82,68.56 84.8,65.53
  Bottom 0.889: v92.78,65.53 84.8,65.53 v76.77,65.53 70.52,59.28 69.13,59.28 v67.81,60.6 67.81,62.81 66.89,63.73 51.91,63.73 50.61,62.43 46.73,62.43 v45.05,60.76 | v57.67,4.17 72.01,4.17
VCC3O
  Top 0.305: IC5.17 69.53,49.62 68.83,49.62 68.39,50.06 C18.1
VSYNC
  Top 0.152: LCD_CONN.P33 102.54,70.19 U$2.26
XTAL1  (1 unrouted)
  Top 0.305: 68.39,69.22 Q1.2 | C2.2 70.42,66.57 69.38,65.53 62.47,65.53 61.53,66.47 61.56,66.5 61.56,67.33 63.44,69.22 Q1.2 | Q1.2 63.59,69.22
(copper drawn outside any net)
  shapes: Top area x1